# EAGLE design BOOSTXL_C2KLED (EAGLE 5.11)

## Sheet 1 of 4
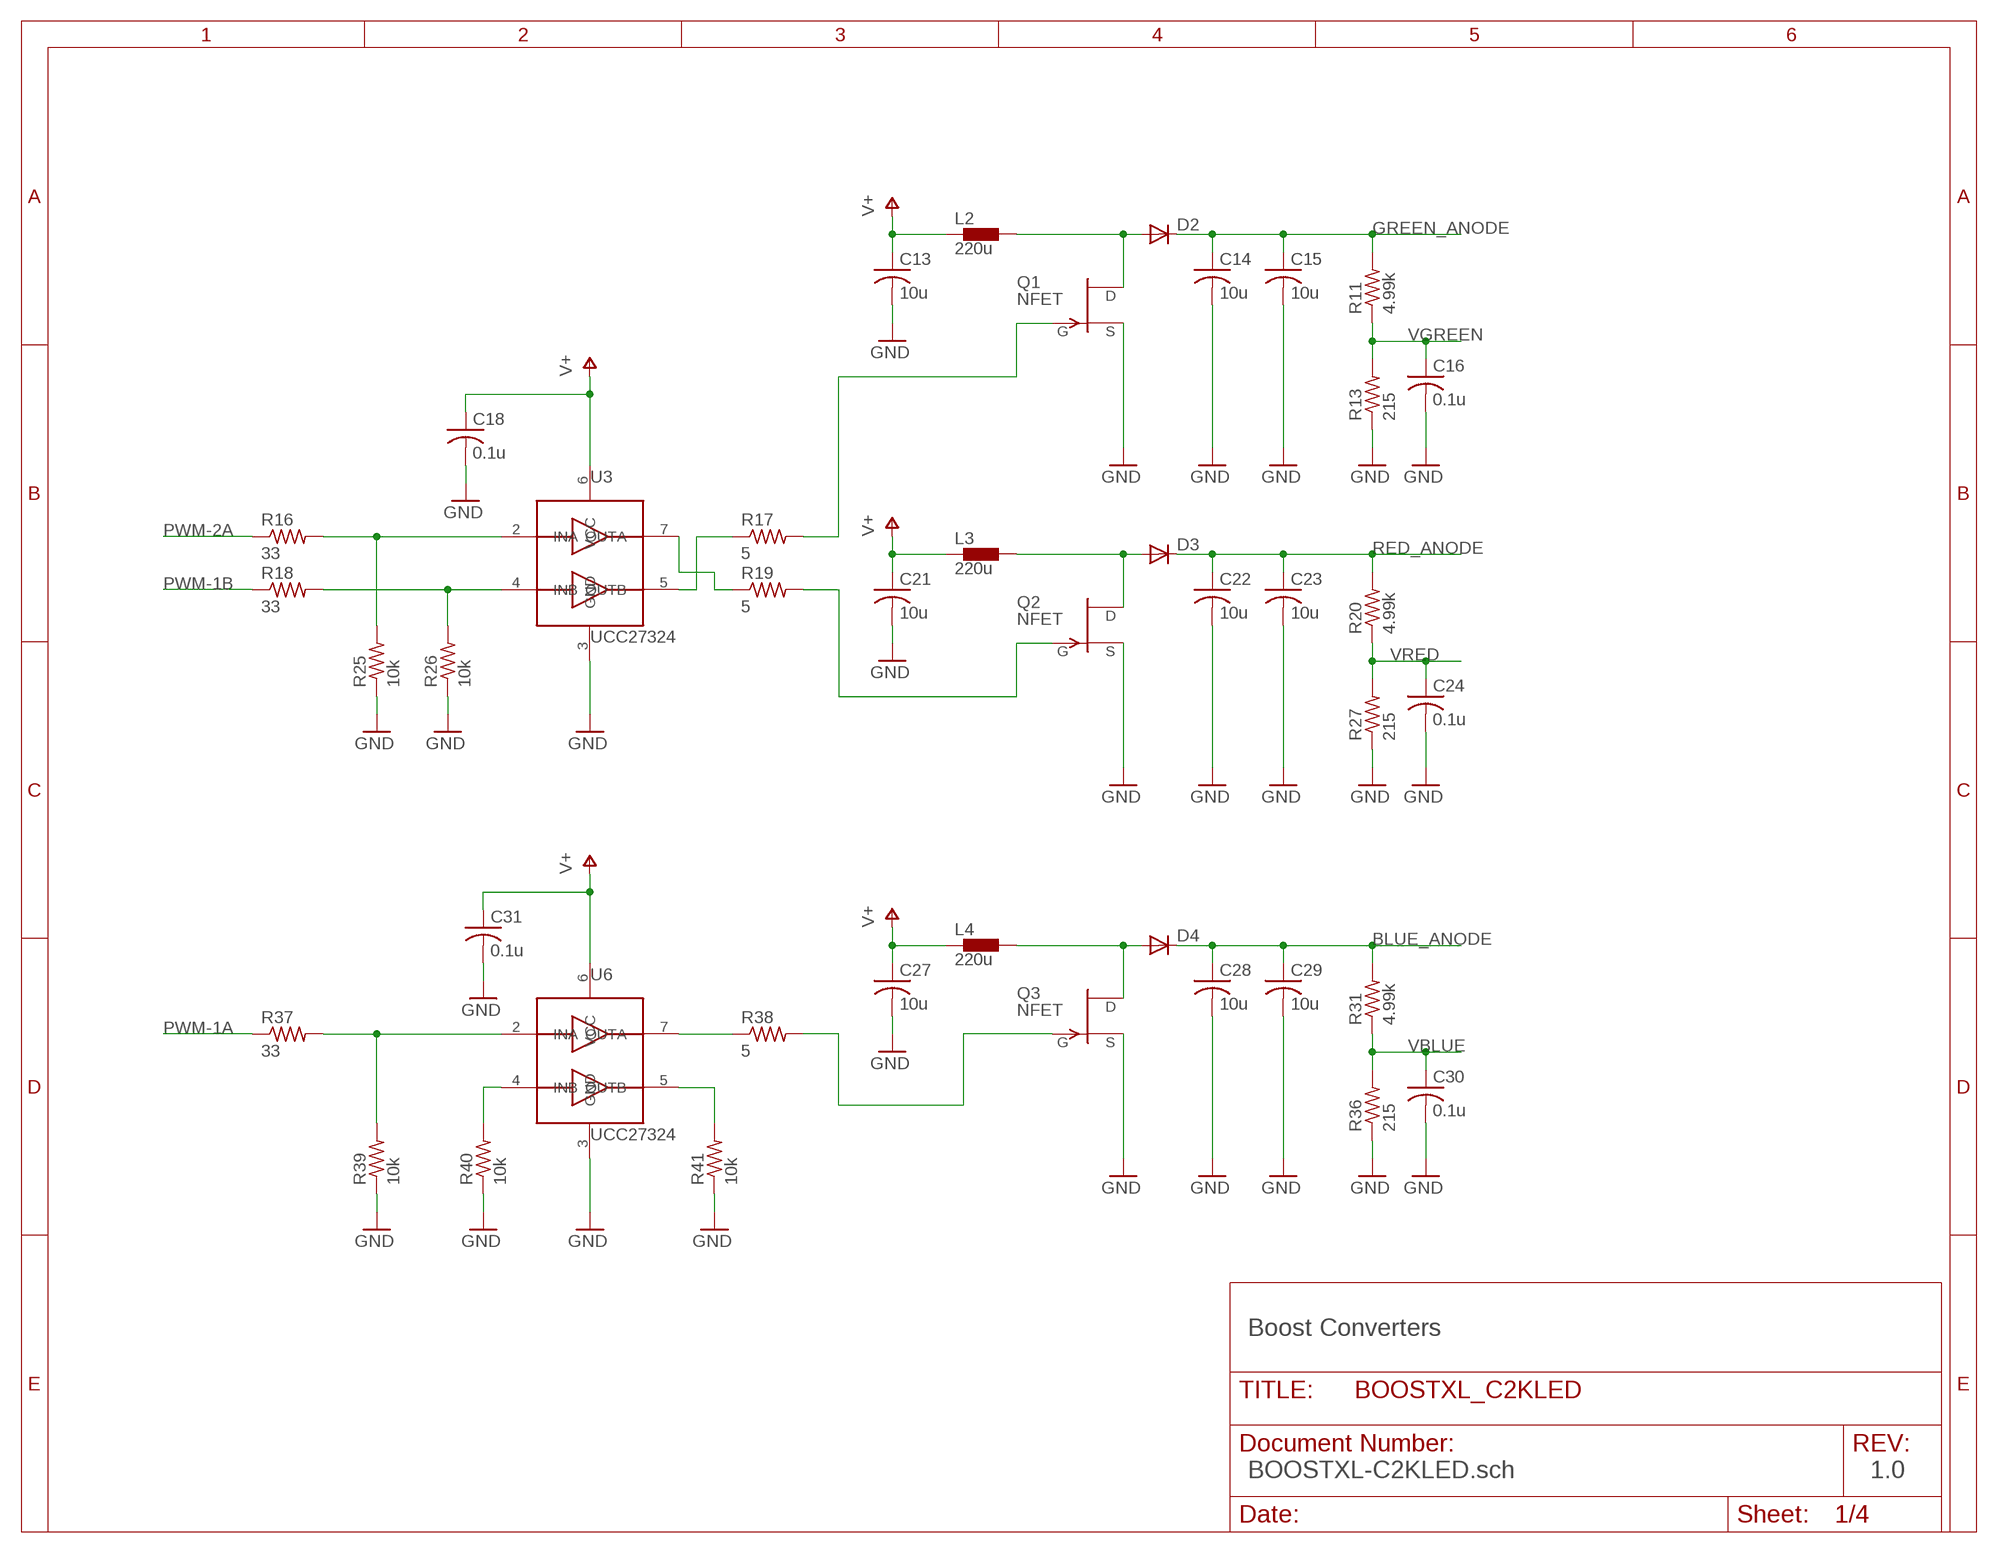
[diagram p0: schematic, sheet 1]

### Parts
C13  10u  C-USC1210  [C1210]
C14  10u  C-USC1210  [C1210]
C15  10u  C-USC1210  [C1210]
C16  0.1u  C-USC0402  [C0402]
C18  0.1u  C-USC0402  [C0402]
C21  10u  C-USC1210  [C1210]
C22  10u  C-USC1210  [C1210]
C23  10u  C-USC1210  [C1210]
C24  0.1u  C-USC0402  [C0402]
C27  10u  C-USC1210  [C1210]
C28  10u  C-USC1210  [C1210]
C29  10u  C-USC1210  [C1210]
C30  0.1u  C-USC0402  [C0402]
C31  0.1u  C-USC0402  [C0402]
D2  DIODE-DO214AC  [DO214AC]
D3  DIODE-DO214AC  [DO214AC]
D4  DIODE-DO214AC  [DO214AC]
L2  220u  SRR7032  [SRR7032]
L3  220u  SRR7032  [SRR7032]
L4  220u  SRR7032  [SRR7032]
Q1  NFET  [TO252]
Q2  NFET  [TO252]
Q3  NFET  [TO252]
R11  4.99k  R-US_R0402  [R0402]
R13  215  R-US_R0402  [R0402]
R16  33  R-US_R0402  [R0402]
R17  5  R-US_R0402  [R0402]
R18  33  R-US_R0402  [R0402]
R19  5  R-US_R0402  [R0402]
R20  4.99k  R-US_R0402  [R0402]
R25  10k  R-US_R0402  [R0402]
R26  10k  R-US_R0402  [R0402]
R27  215  R-US_R0402  [R0402]
R31  4.99k  R-US_R0402  [R0402]
R36  215  R-US_R0402  [R0402]
R37  33  R-US_R0402  [R0402]
R38  5  R-US_R0402  [R0402]
R39  10k  R-US_R0402  [R0402]
R40  10k  R-US_R0402  [R0402]
R41  10k  R-US_R0402  [R0402]
U3  UCC27324  [SO-08]
U6  UCC27324  [SO-08]

### Nets
BLUE_ANODE: C28.1 C29.1 D4.C R31.2 ; also sheet 2
GND: C13.2 C14.2 C15.2 C16.2 C18.2 C21.2 C22.2 C23.2 C24.2 C27.2 C28.2 C29.2 C30.2 C31.2 Q1.2(S) Q2.2(S) Q3.2(S) R13.1 R25.1 R26.1 R27.1 R36.1 R39.1 R40.1 R41.1 U3.3(GND) U6.3(GND) ; also sheet 2,3,4
GREEN_ANODE: C14.1 C15.1 D2.C R11.2 ; also sheet 2
N$15: R16.2 R25.2 U3.2(INA)
N$16: R38.1 U6.7(OUTA)
N$24: R17.1 U3.5(OUTB)
N$31: R18.2 R26.2 U3.4(INB)
N$32: Q3.1(G) R38.2
N$33: D4.A L4.P$2 Q3.3(D)
N$34: R37.2 R39.2 U6.2(INA)
N$43: R19.1 U3.7(OUTA)
N$44: Q2.1(G) R19.2
N$45: Q1.1(G) R17.2
N$46: D2.A L2.P$2 Q1.3(D)
N$47: D3.A L3.P$2 Q2.3(D)
N$85: R40.2 U6.4(INB)
N$86: R41.2 U6.5(OUTB)
PWM-1A: R37.1 ; also sheet 4
PWM-1B: R18.1 ; also sheet 4
PWM-2A: R16.1 ; also sheet 4
RED_ANODE: C22.1 C23.1 D3.C R20.2 ; also sheet 2
V+: C13.1 C18.1 C21.1 C27.1 C31.1 L2.P$1 L3.P$1 L4.P$1 U3.6(VCC) U6.6(VCC) ; also sheet 3
VBLUE: C30.1 R31.1 R36.2 ; also sheet 4
VGREEN: C16.1 R11.1 R13.2 ; also sheet 4
VRED: C24.1 R20.1 R27.2 ; also sheet 4

### Notes on the sheet
- Boost Converters
- BOOSTXL-C2KLED.sch | 1.0

## Sheet 2 of 4
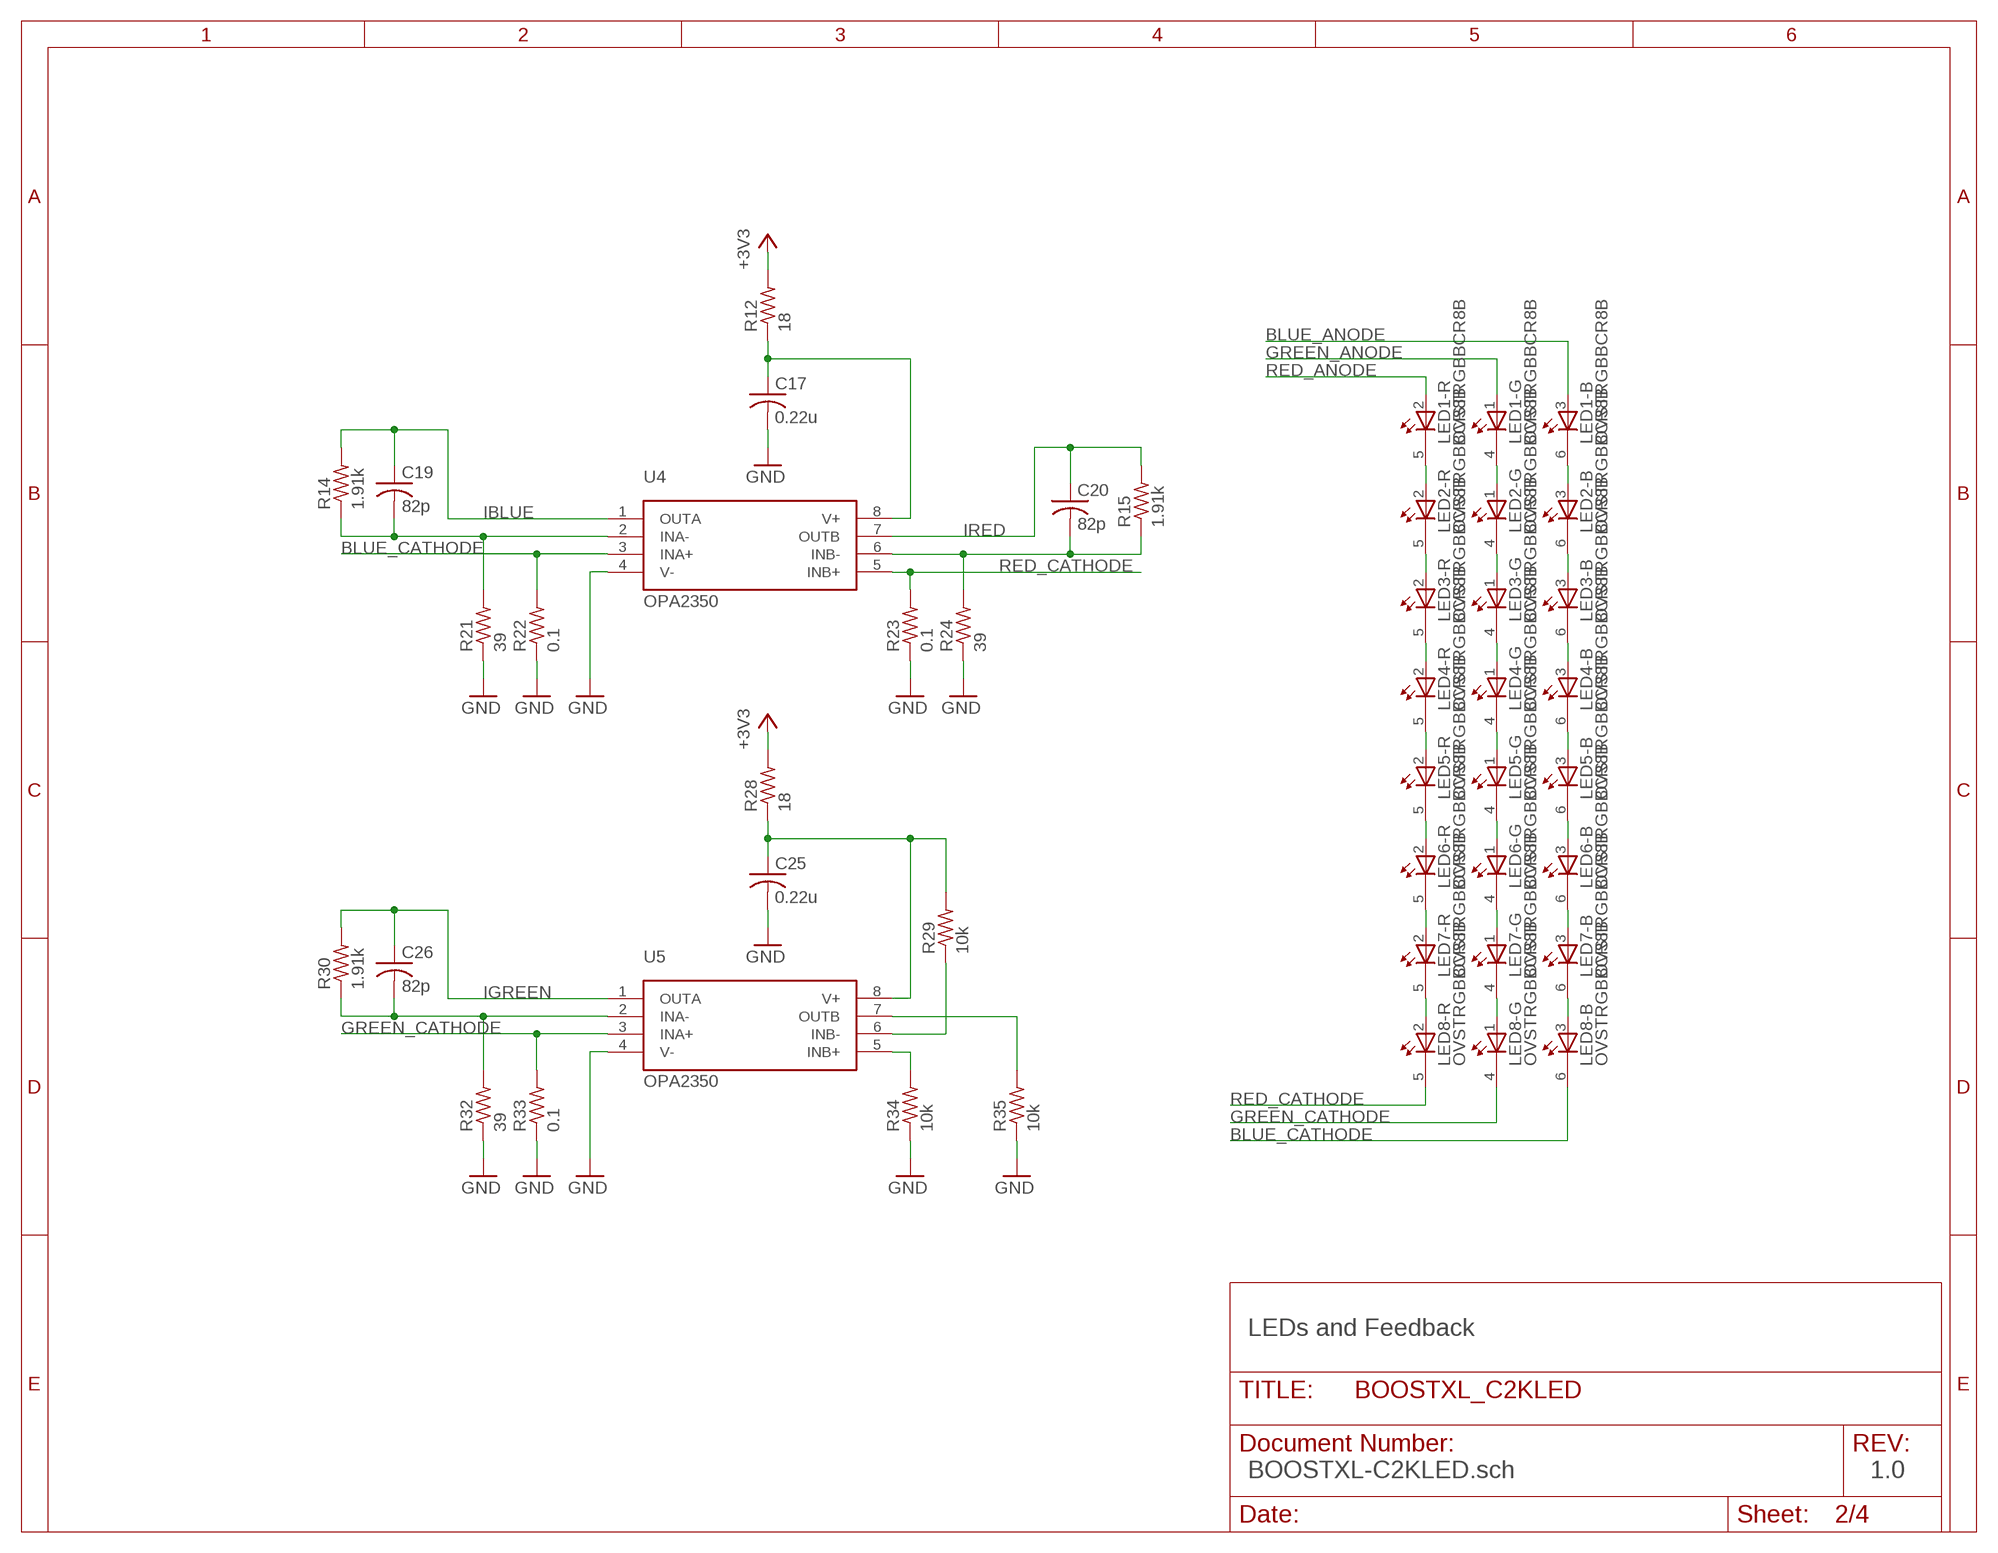
[diagram p1: schematic, sheet 2]

### Parts
C17  0.22u  C-USC0402  [C0402]
C19  82p  C-USC0402  [C0402]
C20  82p  C-USC0402  [C0402]
C25  0.22u  C-USC0402  [C0402]
C26  82p  C-USC0402  [C0402]
LED1  OVSTRGBBCR8B  [OVSTRGBBCR8-EVERLIGHT]
LED2  OVSTRGBBCR8B  [OVSTRGBBCR8-EVERLIGHT]
LED3  OVSTRGBBCR8B  [OVSTRGBBCR8-EVERLIGHT]
LED4  OVSTRGBBCR8B  [OVSTRGBBCR8-EVERLIGHT]
LED5  OVSTRGBBCR8B  [OVSTRGBBCR8-EVERLIGHT]
LED6  OVSTRGBBCR8B  [OVSTRGBBCR8-EVERLIGHT]
LED7  OVSTRGBBCR8B  [OVSTRGBBCR8-EVERLIGHT]
LED8  OVSTRGBBCR8B  [OVSTRGBBCR8-EVERLIGHT]
R12  18  R-US_R0402  [R0402]
R14  1.91k  R-US_R0402  [R0402]
R15  1.91k  R-US_R0402  [R0402]
R21  39  R-US_R0402  [R0402]
R22  0.1  R-US_R1206  [R1206]
R23  0.1  R-US_R1206  [R1206]
R24  39  R-US_R0402  [R0402]
R28  18  R-US_R0402  [R0402]
R29  10k  R-US_R0402  [R0402]
R30  1.91k  R-US_R0402  [R0402]
R32  39  R-US_R0402  [R0402]
R33  0.1  R-US_R1206  [R1206]
R34  10k  R-US_R0402  [R0402]
R35  10k  R-US_R0402  [R0402]
U4  OPA2350  [SO-08]
U5  OPA2350  [SO-08]

### Nets
+3V3: R12.2 R28.2 ; also sheet 3,4
BLUE_ANODE: LED1.3(-B:A) ; also sheet 1
BLUE_CATHODE: LED8.6(-B:C) R22.2 U4.3(INA+)
GND: C17.2 C25.2 R21.1 R22.1 R23.1 R24.1 R32.1 R33.1 R34.1 R35.1 U4.4(V-) U5.4(V-) ; also sheet 1,3,4
GREEN_ANODE: LED1.1(-G:A) ; also sheet 1
GREEN_CATHODE: LED8.4(-G:C) R33.2 U5.3(INA+)
IBLUE: C19.1 R14.2 U4.1(OUTA) ; also sheet 4
IGREEN: C26.1 R30.2 U5.1(OUTA) ; also sheet 4
IRED: C20.1 R15.2 U4.7(OUTB) ; also sheet 4
N$14: LED1.5(-R:C) LED2.2(-R:A)
N$17: LED1.4(-G:C) LED2.1(-G:A)
N$18: LED1.6(-B:C) LED2.3(-B:A)
N$21: LED2.5(-R:C) LED3.2(-R:A)
N$22: LED2.4(-G:C) LED3.1(-G:A)
N$23: LED2.6(-B:C) LED3.3(-B:A)
N$25: LED3.5(-R:C) LED4.2(-R:A)
N$26: LED3.4(-G:C) LED4.1(-G:A)
N$27: LED3.6(-B:C) LED4.3(-B:A)
N$28: LED4.5(-R:C) LED5.2(-R:A)
N$35: R35.2 U5.7(OUTB)
N$36: C26.2 R30.1 R32.2 U5.2(INA-)
N$37: C19.2 R14.1 R21.2 U4.2(INA-)
N$39: C25.1 R28.1 R29.2 U5.8(V+)
N$40: C20.2 R15.1 R24.2 U4.6(INB-)
N$42: C17.1 R12.1 U4.8(V+)
N$50: LED4.4(-G:C) LED5.1(-G:A)
N$51: LED4.6(-B:C) LED5.3(-B:A)
N$59: LED5.5(-R:C) LED6.2(-R:A)
N$60: LED5.4(-G:C) LED6.1(-G:A)
N$61: LED5.6(-B:C) LED6.3(-B:A)
N$62: LED6.5(-R:C) LED7.2(-R:A)
N$63: LED6.4(-G:C) LED7.1(-G:A)
N$64: LED6.6(-B:C) LED7.3(-B:A)
N$65: LED7.5(-R:C) LED8.2(-R:A)
N$66: LED7.4(-G:C) LED8.1(-G:A)
N$67: LED7.6(-B:C) LED8.3(-B:A)
N$71: R29.1 U5.6(INB-)
N$72: R34.2 U5.5(INB+)
RED_ANODE: LED1.2(-R:A) ; also sheet 1
RED_CATHODE: LED8.5(-R:C) R23.2 U4.5(INB+)
Unconnected: LED1.4@1(-G:C) LED1.5@1(-R:C) LED1.6@1(-B:C) LED2.4@1(-G:C) LED2.5@1(-R:C) LED2.6@1(-B:C) LED3.4@1(-G:C) LED3.5@1(-R:C) LED3.6@1(-B:C) LED4.4@1(-G:C) LED4.5@1(-R:C) LED4.6@1(-B:C) LED5.4@1(-G:C) LED5.5@1(-R:C) LED5.6@1(-B:C) LED6.4@1(-G:C) LED6.5@1(-R:C) LED6.6@1(-B:C) LED7.4@1(-G:C) LED7.5@1(-R:C) LED7.6@1(-B:C) LED8.4@1(-G:C) LED8.5@1(-R:C) LED8.6@1(-B:C)

### Notes on the sheet
- LEDs and Feedback
- BOOSTXL-C2KLED.sch | 1.0

## Sheet 3 of 4
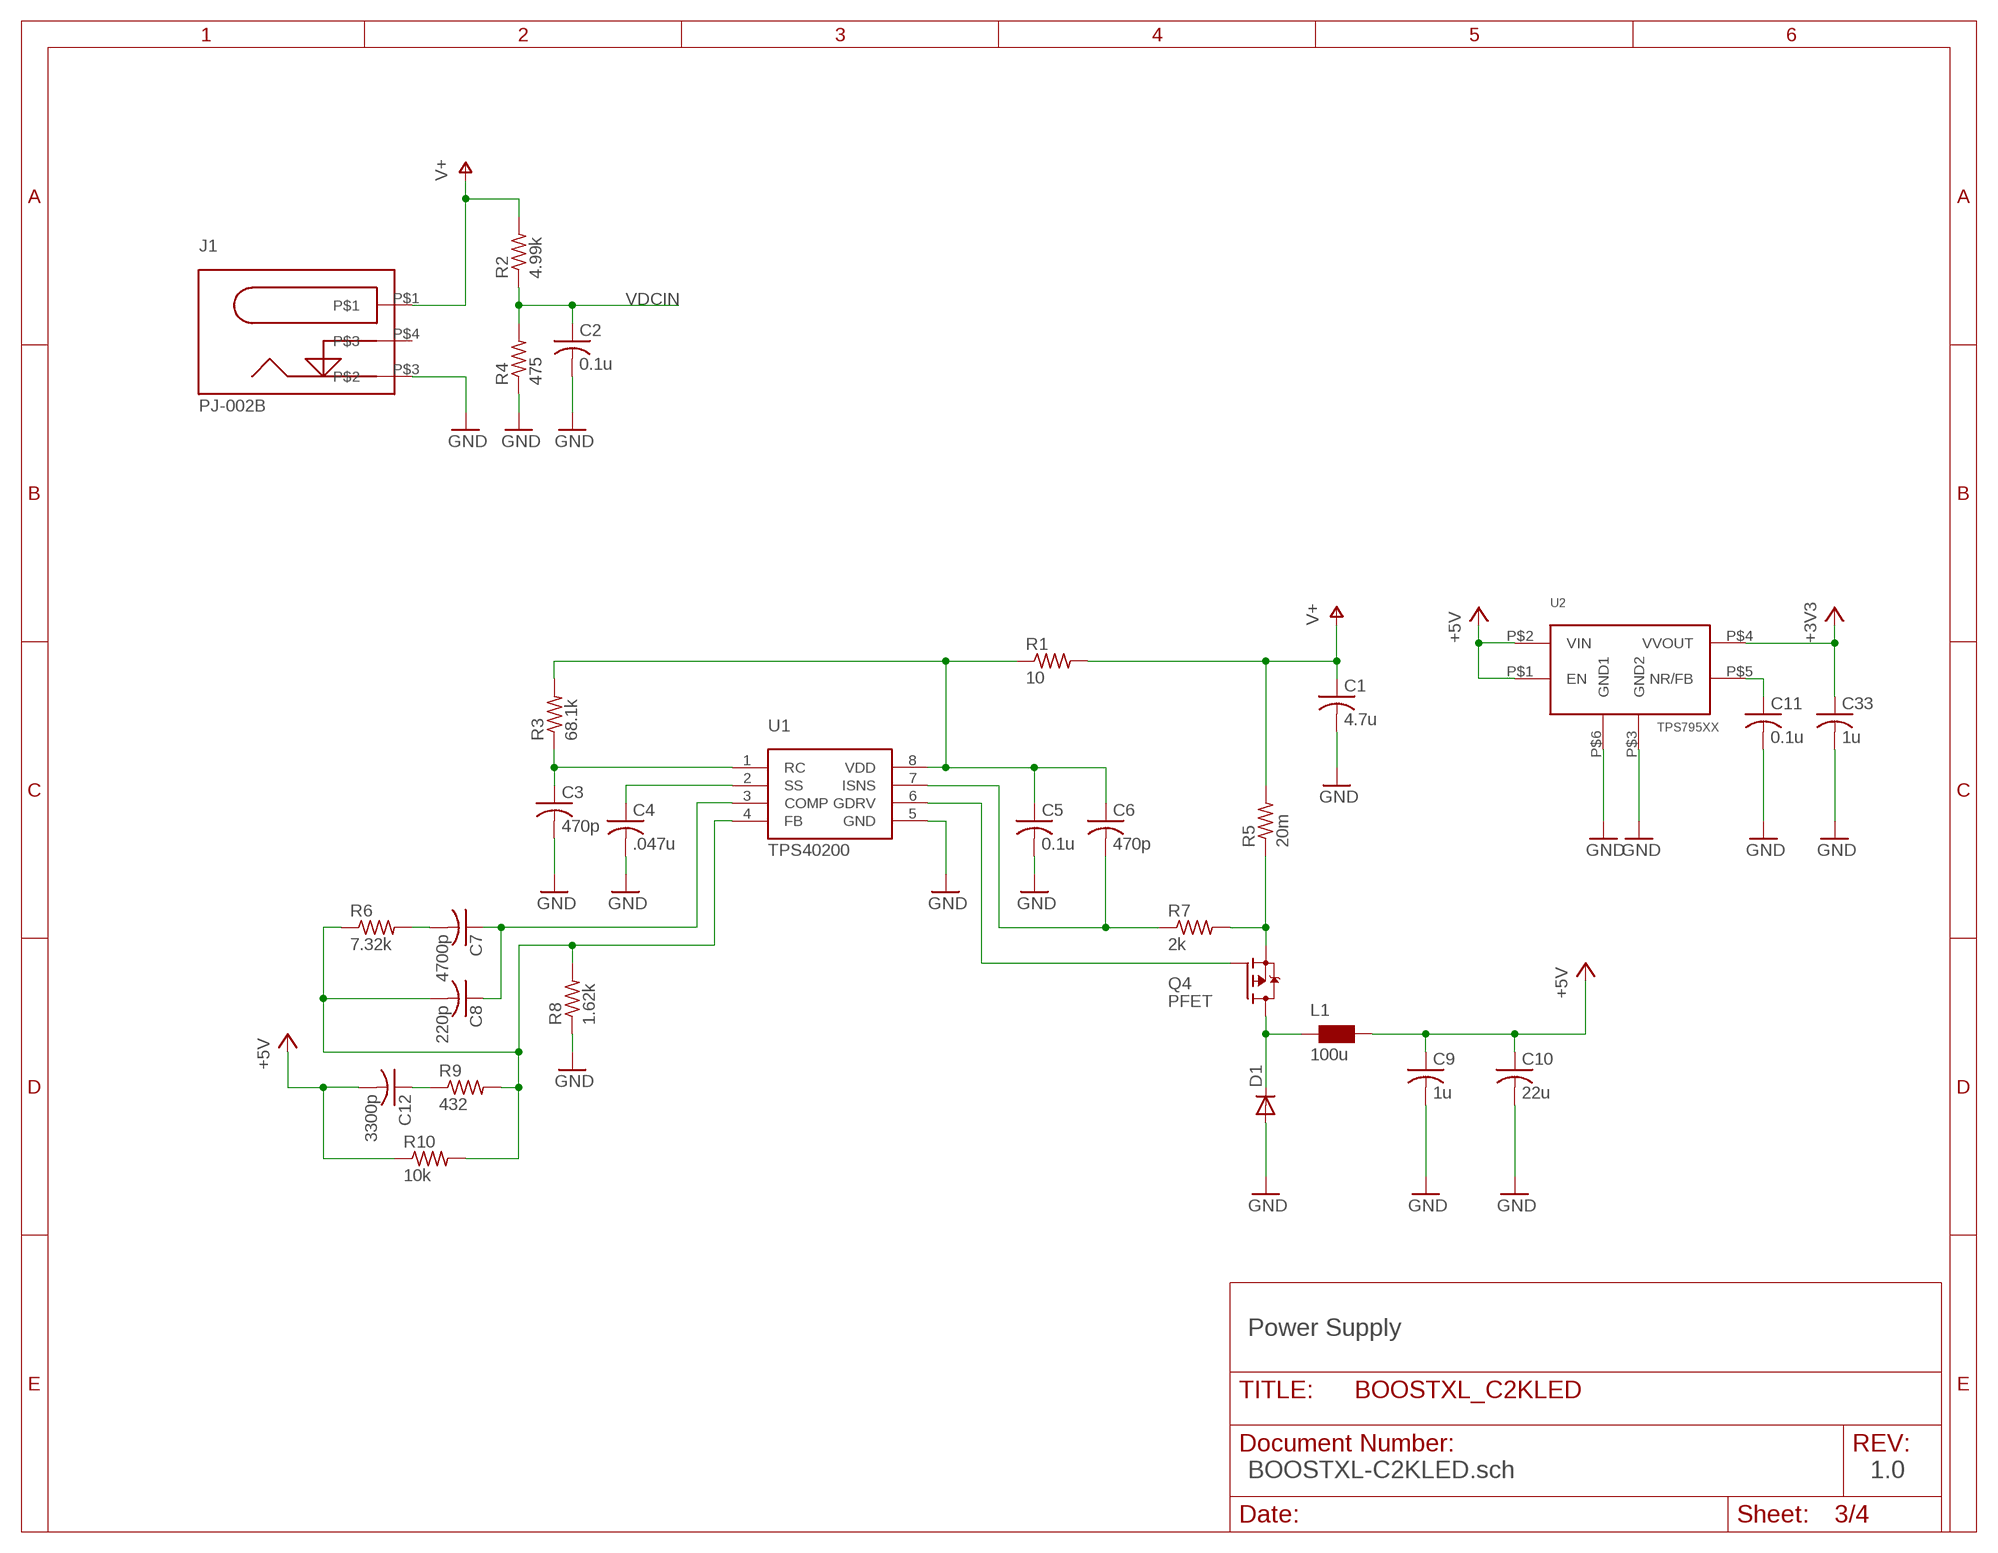
[diagram p2: schematic, sheet 3]

### Parts
C1  4.7u  C-USC1206  [C1206]
C2  0.1u  C-USC0402  [C0402]
C3  470p  C-USC0402  [C0402]
C4  .047u  C-USC0402  [C0402]
C5  0.1u  C-USC0402  [C0402]
C6  470p  C-USC0402  [C0402]
C7  4700p  C-USC0402  [C0402]
C8  220p  C-USC0402  [C0402]
C9  1u  C-USC0402  [C0402]
C10  22u  C-USC1206  [C1206]
C11  0.1u  C-USC0402  [C0402]
C12  3300p  C-USC0402  [C0402]
C33  1u  C-USC0402  [C0402]
D1  DIODE-DO214AC  [DO214AC]
J1  PJ-002B  [PJ-002B-SMT]
L1  100u  WE-PD2_L  [WE-PD2_L]
Q4  PFET  [SOT23]
R1  10  R-US_R0402  [R0402]
R2  4.99k  R-US_R0402  [R0402]
R3  68.1k  R-US_R0402  [R0402]
R4  475  R-US_R0402  [R0402]
R5  20m  R-US_R2010  [R2010]
R6  7.32k  R-US_R0402  [R0402]
R7  2k  R-US_R0402  [R0402]
R8  1.62k  R-US_R0402  [R0402]
R9  432  R-US_R0402  [R0402]
R10  10k  R-US_R0402  [R0402]
U1  TPS40200  [SO-08]
U2  TPS795XX  [SOT223-6-DCQ]

### Nets
+3V3: C33.1 U2.P$4(VVOUT) ; also sheet 2,4
+5V: C9.1 C10.1 C12.2 L1.1 R10.1 U2.P$1(EN) U2.P$2(VIN) ; also sheet 4
GND: C1.2 C2.2 C3.2 C4.2 C5.2 C9.2 C10.2 C11.2 C33.2 D1.A J1.P$3 R4.1 R8.1 U1.5(GND) U2.P$3(GND2) U2.P$6(GND1) ; also sheet 1,2,4
N$1: C3.1 R3.1 U1.1(RC)
N$2: C4.1 U1.2(SS)
N$3: C7.1 C8.1 U1.3(COMP)
N$5: C7.2 R6.2
N$6: D1.C L1.2 Q4.3(D)
N$7: C12.1 R9.1
N$9: C5.1 C6.1 R1.1 R3.2 U1.8(VDD)
N$10: C6.2 R7.1 U1.7(ISNS)
N$11: Q4.2(S) R5.1 R7.2
N$19: Q4.1(G) U1.6(GDRV)
N$30: C11.1 U2.P$5(NR/FB)
N$52: C8.2 R6.1 R8.2 R9.2 R10.2 U1.4(FB)
V+: C1.1 J1.P$1 R1.2 R2.2 R5.2 ; also sheet 1
VDCIN: C2.1 R2.1 R4.2 ; also sheet 4
Unconnected: J1.P$4

### Notes on the sheet
- Power Supply
- BOOSTXL-C2KLED.sch | 1.0

## Sheet 4 of 4
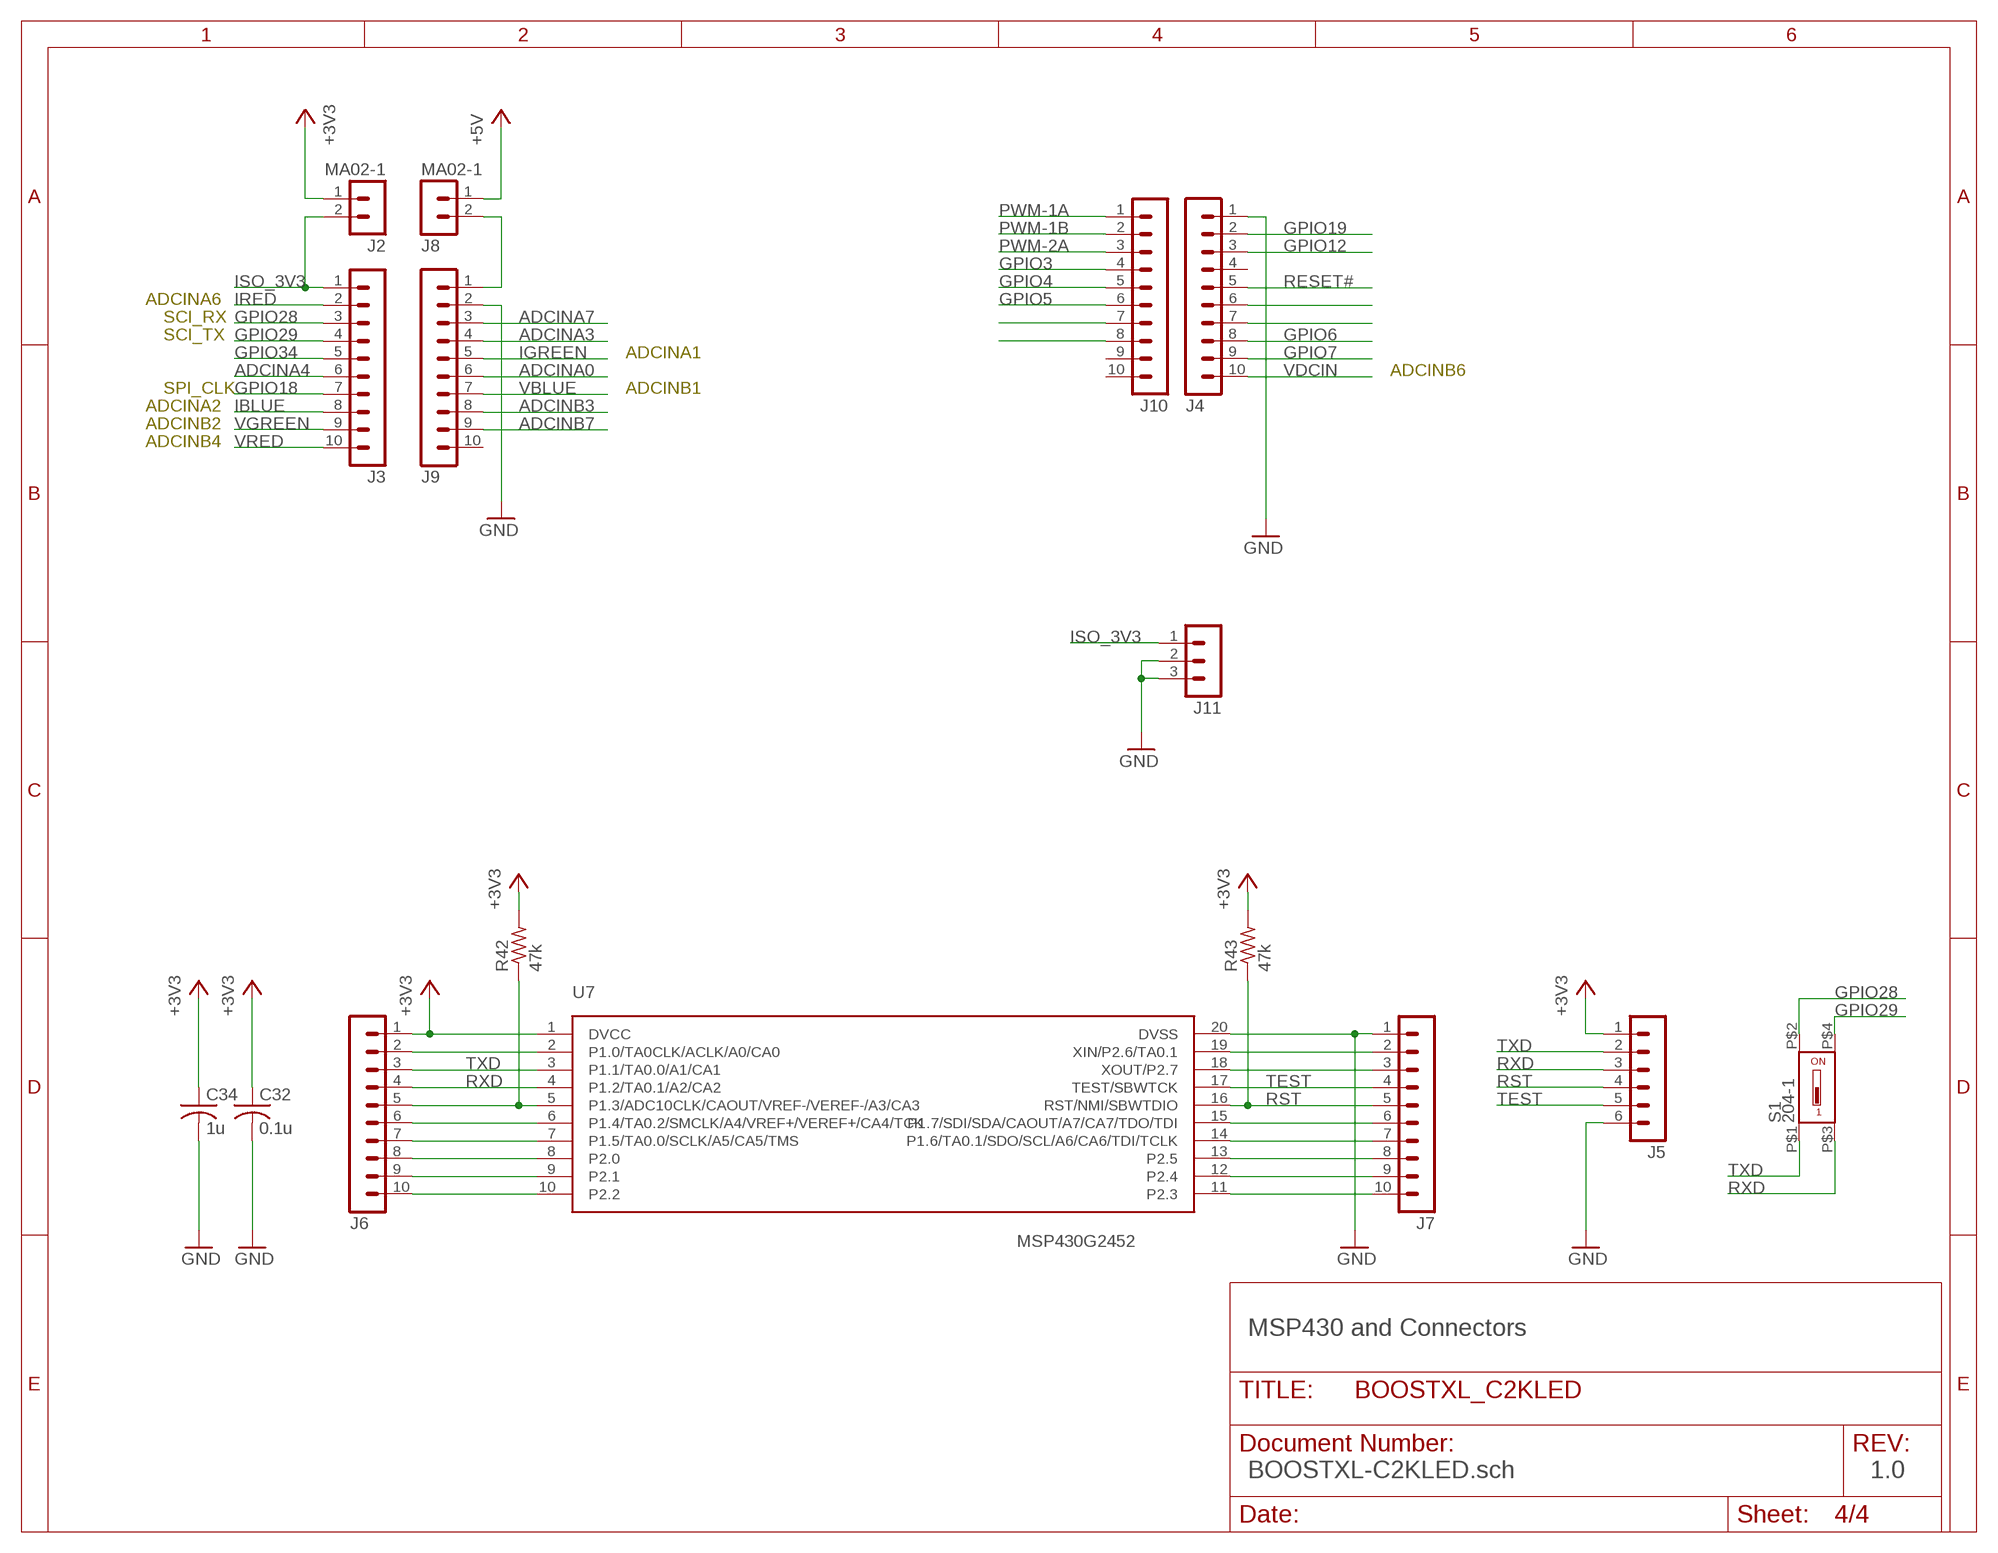
[diagram p3: schematic, sheet 4]

### Parts
C32  0.1u  C-USC0402  [C0402]
C34  1u  C-USC0402  [C0402]
J2  MA02-1  [MA02-1]
J3  MA10-1  [MA10-1]
J4  MA10-1  [MA10-1]
J5  MA06-1  [MA06-1]
J6  MA10-1  [MA10-1]
J7  MA10-1  [MA10-1]
J8  MA02-1  [MA02-1]
J9  MA10-1  [MA10-1]
J10  MA10-1  [MA10-1]
J11  MA03-1  [MA03-1]
R42  47k  R-US_R0402  [R0402]
R43  47k  R-US_R0402  [R0402]
S1  204-1  [CTS-204-1]
U7  MSP430G2452  [PW_R-PDSO-G20]

### Nets
+3V3: C32.1 C34.1 J2.1 J5.1 J6.1 R42.2 R43.2 U7.1(DVCC) ; also sheet 2,3
+5V: J8.1 ; also sheet 3
ADCINA0: J9.6
ADCINA3: J9.4
ADCINA4: J3.6
ADCINA7: J9.3
ADCINB3: J9.8
ADCINB7: J9.9
GND: C32.2 C34.2 J4.1 J5.6 J7.1 J9.2 J11.2 J11.3 U7.20(DVSS) ; also sheet 1,2,3
GPIO3: J10.4
GPIO4: J10.5
GPIO5: J10.6
GPIO6: J4.8
GPIO7: J4.9
GPIO12: J4.3
GPIO18: J3.7
GPIO19: J4.2
GPIO28: J3.3 S1.P$2
GPIO29: J3.4 S1.P$4
GPIO34: J3.5
IBLUE: J3.8 ; also sheet 2
IGREEN: J9.5 ; also sheet 2
IRED: J3.2 ; also sheet 2
ISO_3V3: J2.2 J3.1 J11.1
N$4: J6.10 U7.10(P2.2)
N$8: J6.9 U7.9(P2.1)
N$12: J6.8 U7.8(P2.0)
N$13: J4.6
N$20: J6.7 U7.7(P1.5/TA0.0/SCLK/A5/CA5/TMS)
N$29: J6.6 U7.6(P1.4/TA0.2/SMCLK/A4/VREF+/VEREF+/CA4/TCK)
N$38: J6.5 R42.1 U7.5(P1.3/ADC10CLK/CAOUT/VREF-/VEREF-/A3/CA3)
N$48: J4.7
N$49: J6.2 U7.2(P1.0/TA0CLK/ACLK/A0/CA0)
N$53: J7.2 U7.19(XIN/P2.6/TA0.1)
N$54: J7.3 U7.18(XOUT/P2.7)
N$55: J10.7
N$56: J10.8
N$57: J7.6 U7.15(P1.7/SDI/SDA/CAOUT/A7/CA7/TDO/TDI)
N$58: J7.7 U7.14(P1.6/TA0.1/SDO/SCL/A6/CA6/TDI/TCLK)
N$68: J7.8 U7.13(P2.5)
N$69: J7.9 U7.12(P2.4)
N$70: J7.10 U7.11(P2.3)
N$75: J8.2 J9.1
PWM-1A: J10.1 ; also sheet 1
PWM-1B: J10.2 ; also sheet 1
PWM-2A: J10.3 ; also sheet 1
RESET#: J4.5
RST: J5.4 J7.5 R43.1 U7.16(RST/NMI/SBWTDIO)
RXD: J5.3 J6.4 S1.P$3 U7.4(P1.2/TA0.1/A2/CA2)
TEST: J5.5 J7.4 U7.17(TEST/SBWTCK)
TXD: J5.2 J6.3 S1.P$1 U7.3(P1.1/TA0.0/A1/CA1)
VBLUE: J9.7 ; also sheet 1
VDCIN: J4.10 ; also sheet 3
VGREEN: J3.9 ; also sheet 1
VRED: J3.10 ; also sheet 1
Unconnected: J4.4 J9.10 J10.9 J10.10

### Notes on the sheet
- ADCINA6
- SCI_RX
- SCI_TX
- ADCINA1
- ADCINB6
- SPI_CLK | ADCINB1
- ADCINA2
- ADCINB2
- ADCINB4
- MSP430 and Connectors
- BOOSTXL-C2KLED.sch | 1.0

## Library data of the parts
C1-C34 = rcl:C-US: CAPACITOR, American symbol
D1-D4 = diode:DIODE-: DIODE
J1 = con-cui:PJ-002B
J2 J8 = con-lstb:MA02-1
J3 J4 J6 J7 J9 J10 = con-lstb:MA10-1: PIN HEADER; OC_FARNELL: unknown; OC_NEWARK: unknown
J5 = con-lstb:MA06-1: PIN HEADER; OC_FARNELL: unknown; OC_NEWARK: unknown
J11 = con-lstb:MA03-1: PIN HEADER; OC_FARNELL: unknown; OC_NEWARK: unknown
L1 = wuerth-elektronik:WE-PD2: SMD-Power Inductors WE-PD2 Is recommended for the application with switching regulators from National Semiconductor, Linear Technology, Texas Instruments and Fairchild Semiconductor -- Switching regulators with low operating voltages (computer, laptop, mobile phones, pagers) -- Integrated DC/DC-converter
L2-L4 = inductors:SRR7032
LED1-LED8 = texas:OVSTRGBBCR8: Full Color PLCC6 LED OVSTRGBBCR8 Source: www.optekinc.com .. ovstrgbbcr8.pdf
Q1-Q3 = texas:NFET
Q4 = transistor-fet:PFET
R1-R43 = rcl:R-US_: RESISTOR, American symbol
S1 = switch-dil:204-1*
U1 = texas:TPS40200
U2 = texas:TPS795XX
U3 U6 = texas:UCC27324
U4 U5 = texas:OPA2350
U7 = texas:MSP430G2452

## Net classes
0 default: width 0.152 mm, drill 0.305 mm, clearance 0.152 mm

## Board
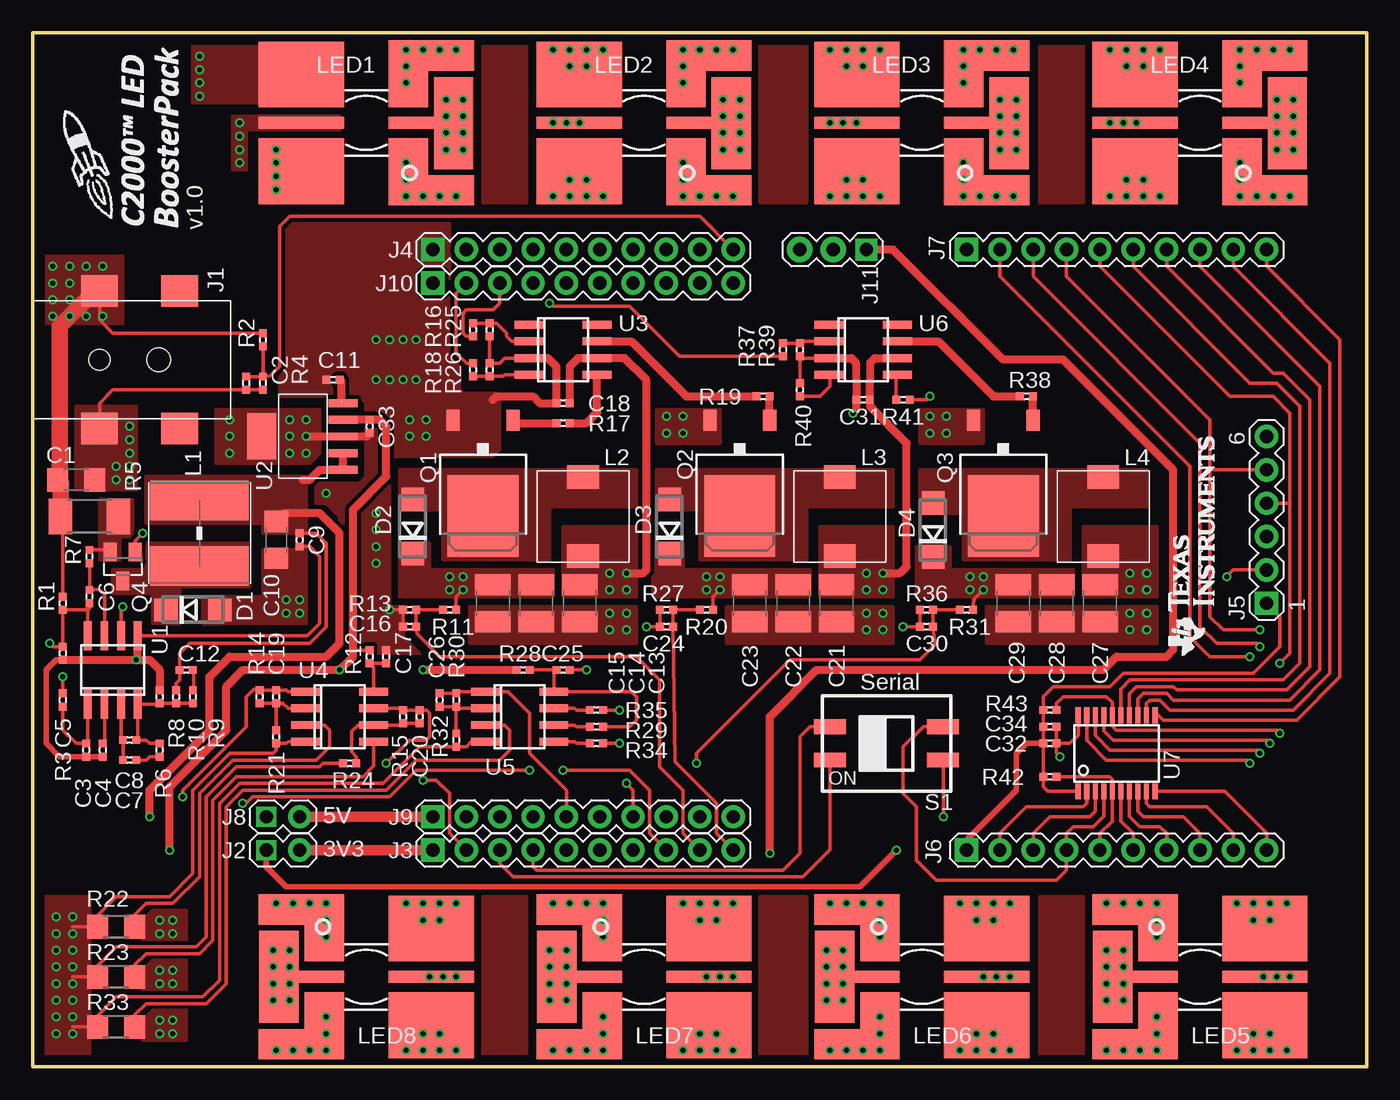
[diagram p4: board, top side]
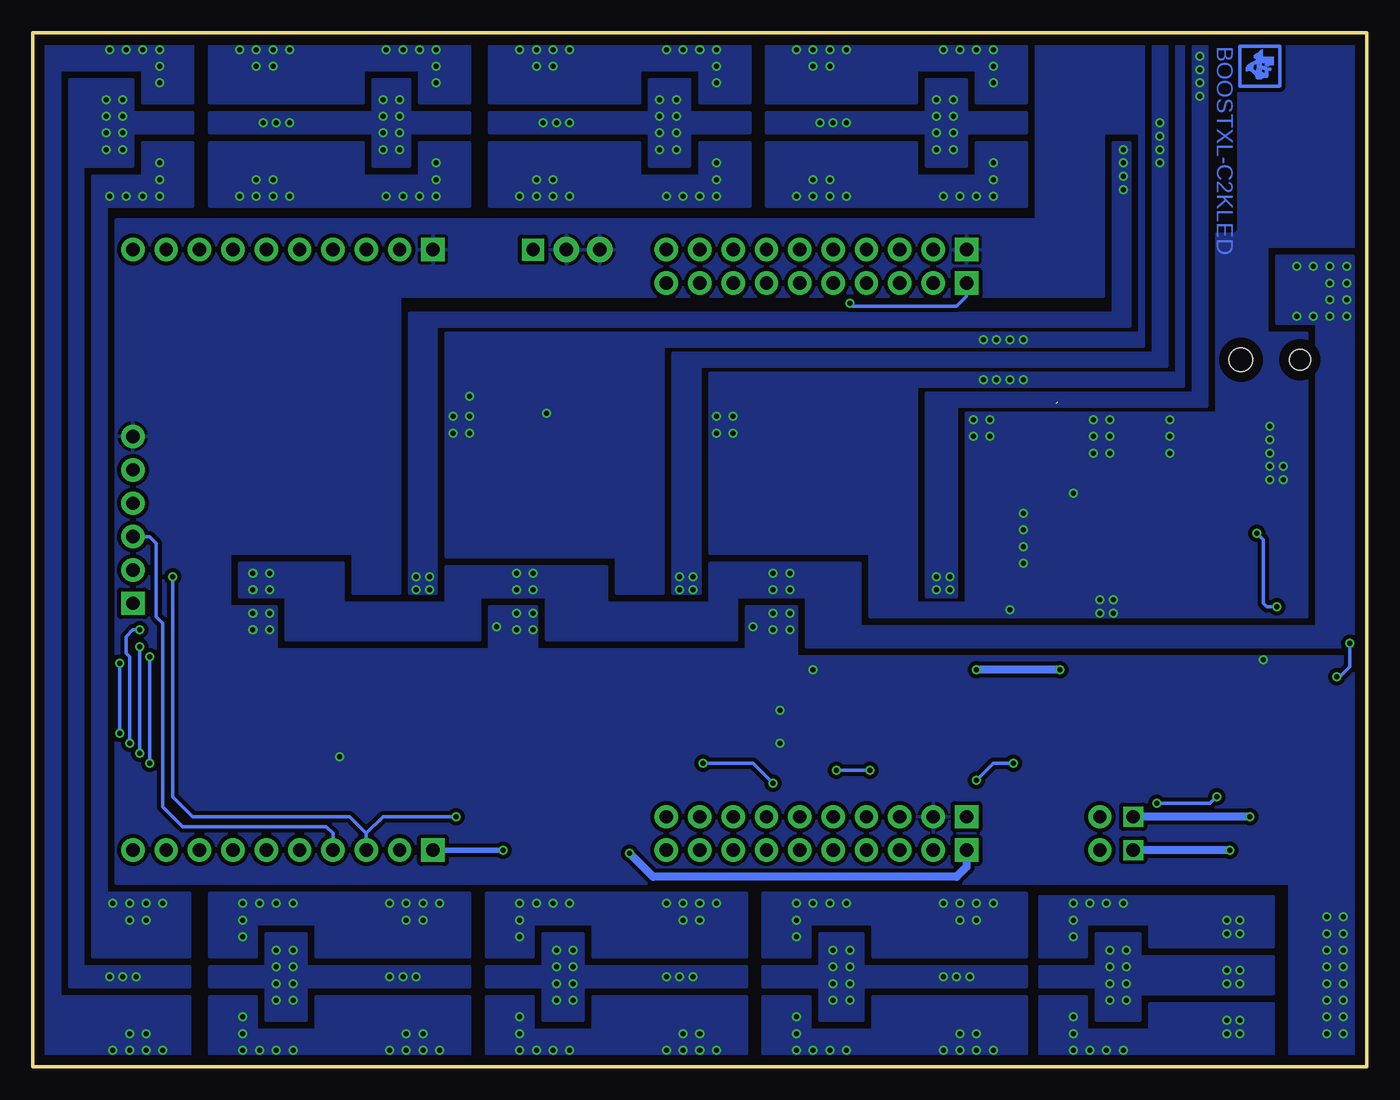
[diagram p5: board, bottom side, seen from below]

Size 101.6 x 78.74 mm. Coordinates in mm from the lower left corner, seen from the top.
Outline: 0,78.74 101.6,78.74 101.6,0 0,0 0,78.74
Copper layers (1*16): Top 0.035mm / dielectric 1.5mm / Bottom 0.035mm
Design rules "default *": minimum track width 6mil, minimum drill 15mil, track to track 6mil, track to pad 6mil, pad to pad 6mil, via to via 6mil, smd to smd 6mil, copper to edge 30mil, drill to drill 12mil, minimum pad ring 6mil, minimum via ring 6mil, stop-mask expansion 1mil, vias tented up to drill 20mil, thermal gap 10mil
bRestrict: area 6.9,74.9 to 9.4,77.5

### Footprints (pad centres in the part's own frame; a part is rotated, then mirrored left to right if it is on the bottom)
C1206 = smd 1.6 x 1.8: 1 -1.4,0; 2 1.4,0
C0402 = smd 0.6 x 0.6: 1 -0.5,0; 2 0.5,0
C1210 = smd 1.6 x 2.7: 1 -1.4,0; 2 1.4,0
DO214AC = smd 1.8 x 1.7: A 2.05,0; C -2.05,0
PJ-002B-SMT = smd 2.8 x 2.4: P$1 0,5.25; P$2 6.1,5.25; P$3 0,-5.25; P$4 6.1,-5.25 | hole 1.6: 0,0 | hole 1.8: 4.5,0
MA02-1 = drill 1.016 square: 1 -1.27,0 | drill 1.016 pad 1.778 round: 2 1.27,0
MA10-1 = drill 1.016 pad 1.778 square: 1 -11.43,0 | drill 1.016 pad 1.778 round: 2 -8.89,0; 3 -6.35,0; 4 -3.81,0; 5 -1.27,0; 6 1.27,0; 7 3.81,0; 8 6.35,0; 9 8.89,0; 10 11.43,0
MA06-1 = drill 1.016 pad 1.778 square: 1 -6.35,0 | drill 1.016 pad 1.778 round: 2 -3.81,0; 3 -1.27,0; 4 1.27,0; 5 3.81,0; 6 6.35,0
MA03-1 = drill 1.016 pad 1.676 square: 1 -2.54,0 | drill 1.016 pad 1.93 round: 2 0,0; 3 2.54,0
WE-PD2_L = smd 3 x 7.5: 1 -2.5,0; 2 2.5,0
SRR7032 = smd 2.4 x 1.8: P$1 0,-3; P$2 0,3
OVSTRGBBCR8-EVERLIGHT = smd 6.5 x 5: 1 -4.942,3.686; 3 -4.942,-3.686 | smd 6.5 x 0.9: 2 -4.942,0 | smd 3 x 5: 4 3.192,3.686; 6 3.192,-3.686 | smd 6.5 x 2.3: 4@1 4.942,5.136; 6@1 4.942,-5.136 | smd 5 x 0.9: 5 4.192,0 | smd 3 x 7: 5@1 6.65,-0.025
TO252 = smd 1 x 1.6: 1 -2.28,-4.8; 2 2.28,-4.8 | smd 5.4 x 6.2: 3 0,2.5
SOT23 = smd 1 x 1.4: 1 -0.95,-1.1; 2 0.95,-1.1; 3 0,1.1
R0402 = smd 0.6 x 0.6: 1 -0.5,0; 2 0.5,0
R2010 = smd 1.8 x 2.7: 1 -2.2,0; 2 2.2,0
R1206 = smd 1.6 x 1.803: 1 -1.422,0; 2 1.422,0
CTS-204-1 = smd 1.118 x 2.438: P$1 -1.27,-4.305; P$2 -1.27,4.305; P$3 1.27,-4.305; P$4 1.27,4.305
SO-08 = smd 0.6 x 2.2: 1 -1.905,-2.6; 2 -0.635,-2.6; 3 0.635,-2.6; 4 1.905,-2.6; 5 1.905,2.6; 6 0.635,2.6; 7 -0.635,2.6; 8 -1.905,2.6
SOT223-6-DCQ = smd 0.6 x 2.2: P$1 -2.54,0; P$2 -1.27,0; P$3 0,0; P$4 1.27,0; P$5 2.54,0 | smd 3.5 x 2.2: P$6 0,6.2
PW_R-PDSO-G20 = smd 0.4 x 1.2: 1 -2.925,-2.9; 2 -2.275,-2.9; 3 -1.625,-2.9; 4 -0.975,-2.9; 5 -0.325,-2.9; 6 0.325,-2.9; 7 0.975,-2.9; 8 1.625,-2.9; 9 2.275,-2.9; 10 2.925,-2.9; 11 2.925,2.9; 12 2.275,2.9; 13 1.625,2.9; 14 0.975,2.9; 15 0.325,2.9; 16 -0.325,2.9; 17 -0.975,2.9; 18 -1.625,2.9; 19 -2.275,2.9; 20 -2.925,2.9

### Placement (x,y rotation side)
C1  3.3,44.7 0 top
C2  16.26,52.07 270 top
C3  4.06,24.13 270 top
C4  5.33,24.13 270 top
C5  2.29,31.5 270 top
C6  4.32,35.81 90 top
C7  7.37,23.37 0 top
C8  7.37,24.89 0 top
C9  20.32,40.13 270 top
C10  18.54,40.13 270 top
C11  22.86,52.32 180 top
C12  11.68,30.23 180 top
C13  41.66,35.31 270 top
C14  38.35,35.31 270 top
C15  35.05,35.31 270 top
C16  28.7,33.53 180 top
C17  26.92,31.24 90 top
C18  40.39,50.55 180 top
C19  18.54,28.19 270 top
C20  29.46,26.67 270 top
C21  61.21,35.31 270 top
C22  57.91,35.31 270 top
C23  54.61,35.31 270 top
C24  48.26,33.53 180 top
C25  40.39,30.23 0 top
C26  30.99,27.94 270 top
C27  81.28,35.31 270 top
C28  77.98,35.31 270 top
C29  74.68,35.31 270 top
C30  68.07,33.53 180 top
C31  63.25,50.8 180 top
C32  77.47,24.64 0 top
C33  25.65,48.77 270 top
C34  77.47,25.91 0 top
D1  12.19,34.8 0 top
D2  28.96,41.15 90 top
D3  48.51,41.15 90 top
D4  68.58,40.89 90 top
J1  5.08,53.85 0 top
J2  19.05,16.51 0 top
J3  41.91,16.51 0 top
J4  41.91,62.23 0 top
J5  93.98,41.66 90 top
J6  82.55,16.51 0 top
J7  82.55,62.23 0 top
J8  19.05,19.05 0 top
J9  41.91,19.05 0 top
J10  41.91,59.69 0 top
J11  60.96,62.23 180 top
L1  12.7,40.64 270 top
L2  41.91,41.91 0 top
L3  61.47,41.91 0 top
L4  81.53,41.91 0 top
LED1  25.4,71.88 0 top
LED2  46.56,71.88 0 top
LED3  67.72,71.88 0 top
LED4  88.9,71.88 0 top
LED5  88.9,6.86 180 top
LED6  67.72,6.86 180 top
LED7  46.56,6.86 180 top
LED8  25.4,6.86 180 top
Q1  34.29,44.45 180 top
Q2  53.85,44.45 180 top
Q3  73.91,44.45 180 top
Q4  6.86,38.1 180 top
R1  2.29,35.31 90 top
R2  17.53,55.37 90 top
R3  2.29,27.94 90 top
R4  17.53,52.07 90 top
R5  4.32,41.91 180 top
R6  9.65,24.13 270 top
R7  4.32,38.86 90 top
R8  9.65,28.19 270 top
R9  12.19,28.19 270 top
R10  10.92,28.19 270 top
R11  31.75,34.8 0 top
R12  25.65,31.24 90 top
R13  28.7,34.8 0 top
R14  17.27,28.19 90 top
R15  28.19,26.67 90 top
R16  33.53,56.13 90 top
R17  40.39,49.02 180 top
R18  33.53,53.09 270 top
R19  55.63,51.05 0 top
R20  51.31,34.8 0 top
R21  18.54,25.15 90 top
R22  6.35,10.67 0 top
R23  6.35,6.86 0 top
R24  24.13,23.11 0 top
R25  34.8,56.13 90 top
R26  34.8,53.09 270 top
R27  48.26,34.8 0 top
R28  37.34,30.23 180 top
R29  42.93,25.91 0 top
R30  32.26,27.94 90 top
R31  71.12,34.8 0 top
R32  32.26,24.89 90 top
R33  6.35,3.05 0 top
R34  42.93,24.64 180 top
R35  42.93,27.18 180 top
R36  68.07,34.8 0 top
R37  57.15,54.61 90 top
R38  75.69,51.05 0 top
R39  58.42,54.61 90 top
R40  58.42,51.56 270 top
R41  66.29,50.8 180 top
R42  77.47,22.1 180 top
R43  77.47,27.18 180 top
S1  65.02,24.64 90 top
U1  6.1,30.23 0 top
U2  23.62,48.01 90 top
U3  40.39,54.61 270 top
U4  23.37,26.67 270 top
U5  37.08,26.67 270 top
U6  63.25,54.61 270 top
U7  82.55,23.88 0 top
U$1  [STI_LOGO_LOGO16_TPLACE]  90.17,31.24 90 top
U$2  [STI_LOGO_LEDBOOST]  11.68,63.5 90 top
U$3  [STI_LOGO_ROCKET]  6.1,64.52 90 top
U$4  [MSP430_LAB_TILOGO_SMALL]  7.87,76.2 270 bottom
U$6  [MSP430_LAB_TILOGO_SMALL_TSTOP]  7.87,76.2 270 bottom

### Tracks (layer width: path | path; a pad name or v marks a point on that pad's centre or on a via)
+3V3  (via drill 0.38)
  Top 0.254: U7.1 77.32,20.98 76.97,21.33 R42.2 C32.1 C34.1 R43.2 76.97,28.2 77.72,28.96 82.04,28.96 83.06,29.97 92.96,29.97 95,32 95,34.29 J5.1 | 24.38,31.75 24.53,31.89 24.68,31.74 R12.2
  Top 0.406: J6.1 71.12,17.27 74.93,21.08 74.93,23.88 75.69,24.64 C32.1 | J2.1 17.78,15.24 19.3,13.72 62.99,13.72 v65.79,16.51
  Top 0.61: v29.72,30.23 R28.2 | v10.41,16.51 10.41,21.34 14.73,25.65 14.73,28.96 16,30.23 v23.37,30.23 24.38,31.24 24.38,31.75 24.38,42.42 26.92,44.96 26.92,48.77 26.42,49.27 C33.1 25.61,49.28 U2.P$4
  Bottom 0.406: v65.79,16.51 J6.1
  Bottom 0.61: v23.37,30.23 v29.72,30.23 | v10.41,16.51 J2.1
+5V  (via drill 0.38)
  Top 0.254: R10.1 10.92,29.21 11.18,29.47 C12.2 11.18,31.5 11.94,32.26 21.08,32.26 22.35,33.53 22.35,39.88 21.6,40.63 C9.1
  Top 0.61: 20.57,44.7 21.08,44.7 21.84,45.47 U2.P$1 U2.P$2 | v8.89,19.05 8.89,21.08 13.46,25.65 13.46,29.72 14.99,31.24 22.35,31.24 23.37,32.26 23.37,40.64 21.84,42.16 19.17,42.16 C10.1
  Bottom 0.61: v8.89,19.05 J8.1
  pour Top (isolate 0.305, no thermals): 20.83,40.64 20.83,44.96 8.64,44.96 8.64,41.4 17.53,41.4 17.53,40.64
BLUE_ANODE  (via drill 0.38)
  Top 0: LED1.3 18.82,68.1 v18.54,67.82
  Top 0.254: R31.2 71.67,35.6 v72.39,36.32
  other vias: 18.54,66.8 71.37,37.34 72.39,37.34 71.37,36.32 18.54,69.85 18.54,68.83
  pour Top (isolate 0.305, no thermals): 67.31,35.81 79.25,35.81 79.25,37.85 69.85,37.85 69.85,39.62 67.31,39.62
  pour Bottom (isolate 0.305): 70.87,56.39 70.87,36.07 72.9,36.07 72.9,57.4 19.3,57.4 19.3,70.36 18.03,70.36 18.03,56.39
BLUE_CATHODE  (via drill 0.38)
  Top 0: LED8.6 22.71,10.82 v22.35,11.18
  Top 0.254: R22.2 7.77,11.58 8.64,12.45 10.67,12.45 12.7,14.48 12.7,20.83 15.24,23.37 21.59,23.37 22.61,24.38 22.61,25.65 22.23,26.04 U4.3
  other vias: 9.65,11.18 10.67,11.18 10.67,10.16 9.65,10.16 18.54,12.45 19.81,12.45 21.08,12.45 22.35,12.45 22.35,9.91
  pour Top (isolate 0.305, no thermals): 9.14,11.94 11.68,11.94 11.68,9.65 8.38,9.65 8.38,11.18
  pour Bottom (isolate 0.305): 7.11,9.14 7.11,12.95 24.89,12.95 24.89,8.38 21.34,8.38 21.34,10.92 16.51,10.92 16.51,9.14
GND  (via drill 0.38)
  Top 0.254: U5.4 33.4,24.77 33.03,24.39 R32.1 29.47,24.39 26.67,21.59 15.75,21.59 14.22,20.07 14.22,6.6 12.95,5.33 6.35,5.33 4.93,3.91 R33.1 | U6.3 58.44,53.97 R39.1 R40.1 | R25.1 R26.1 35.55,53.59 35.94,53.97 U3.3 | C25.2 v42.16,30.23 | J1.P$3 5.08,50.55 6.1,51.57 C2.2 R4.1 | C4.2 C3.2 | U1.5 20.89,32.83 21.84,33.78 21.84,38.86 21.07,39.63 C9.2 | R34.1 v44.7,24.64 | R35.1 v44.7,27.18 | v27.18,34.8 R13.1 C16.2 | R27.1 C24.2 v46.74,33.53 | R36.1 C30.2 v66.29,33.53 | R41.1 68.07,50.8 v68.33,51.05 | C5.2 2.43,30.99 | U7.20 79.62,25.27 78.99,24.64 C32.2 | v78.23,23.62 78.12,23.73 | R22.1 4.93,10.77 | 4.93,10.77 4.93,11.53 6.35,12.95 10.41,12.95 12.19,14.73 12.19,21.08 14.99,23.88 18.29,23.88 18.54,24.13 R21.1 19.31,24.65 19.43,24.77 U4.4 | 4.93,10.77 4.83,10.67 3.05,10.67 | 3.05,6.86 R23.1 4.93,7.72 6.35,9.14 12.45,9.14 13.21,9.91 13.21,20.57 15.49,22.86 21.84,22.86 22.1,23.11 R24.1 | 3.05,3.05 4.57,3.05 | C32.2 C34.2 | v78.23,23.62 78.02,23.83 | C32.2 77.97,23.88 v78.23,23.62
  Top 0.406: C5.2 1.79,31 1.02,30.23 1.02,24.64 2.02,23.63 C4.2
  Top 0.61: U6.3 62.36,53.97 62.7,53.64 C31.2 62.7,50 v62.48,49.78 62.6,49.9 | 35.05,50.8 35.31,51.05 38.1,51.05 38.61,50.55 C18.2 39.89,53.33 39.24,53.97 U3.3 | 2.43,30.99 v7.87,30.99 | R8.1 9.65,30.23 8.89,30.99 v7.87,30.99 | U1.5 8,31.11 v7.87,30.99 | v20.83,48.01 U2.P$3 25.44,48.01 C33.2
  other vias: 45.21,33.27 45.21,34.54 43.94,34.54 43.94,33.27 64.77,33.27 63.5,33.27 63.5,34.54 64.77,34.54 84.84,33.27 83.57,33.27 84.84,34.54 83.57,34.54 29.97,48.01 28.7,48.01 29.97,49.28 28.7,49.28 49.53,48.26 48.26,48.26 49.53,49.53 48.26,49.53 69.6,48.26 68.33,48.26 69.6,49.53 68.33,49.53 7.37,47.75 7.37,48.77 7.37,46.74 6.35,45.72 7.37,45.72 6.35,44.7 7.37,44.7 19.3,35.56 19.3,34.54 20.32,34.54 20.32,35.56 3.05,2.54 1.78,2.54 1.78,3.81 3.05,3.81 3.05,5.08 1.78,5.08 1.78,6.35 3.05,6.35 3.05,7.62 1.78,7.62 1.78,8.89 3.05,8.89 3.05,10.16 1.78,10.16 1.78,11.43 3.05,11.43 19.56,46.74 19.56,48.01 19.56,49.28 20.83,49.28 20.83,46.74 14.99,49.28 14.99,48.01 14.99,46.74 26.16,52.32 27.18,52.32 28.19,52.32 29.21,52.32 27.18,55.37 28.19,55.37 29.21,55.37 26.16,55.37 26.16,38.35 26.16,42.16 26.16,40.89 26.16,39.62 22.35,43.69
  pour Top (isolate 0.305, no thermals): 65.53,32.26 52.83,32.26 52.83,35.05 65.53,35.05
  pour Top (isolate 0.305, no thermals): 85.6,32.26 72.64,32.26 72.64,35.05 85.6,35.05
  pour Top (no thermals): 52.32,47.5 47.5,47.5 47.5,50.04 52.32,50.04
  pour Top (isolate 0.305, no thermals): 72.39,47.5 67.56,47.5 67.56,50.04 72.39,50.04
  pour Top (isolate 0.305, no thermals): 12.95,33.78 12.95,35.81 17.53,35.81 17.53,39.37 20.83,39.37 20.83,33.78
  pour Top (isolate 0.305, no thermals): 3.3,50.29 7.87,50.29 7.87,43.94 3.3,43.94
  pour Top (isolate 0.305, no thermals): 0.51,12.95 0.51,1.02 4.32,1.02 4.32,12.95
  pour Top (isolate 0.305, no thermals): 13.97,45.97 21.08,45.97 21.84,46.74 21.84,50.04 13.97,50.04
  pour Top (isolate 0.305, no thermals): 45.97,35.05 45.97,32.26 33.27,32.26 33.27,35.05
  pour Bottom (isolate 0.305): 0.51,0.51 5.84,0.51 5.84,13.97 95.25,13.97 95.25,64.52 25.15,64.52 25.15,77.72 17.02,77.72 17.02,54.86 53.59,54.86 53.59,36.07 57.15,36.07 57.15,38.86 70.1,38.86 70.1,55.88 17.27,55.88 17.27,71.12 20.07,71.12 20.07,58.67 73.66,58.67 73.66,36.07 77.22,36.07 77.22,39.12 86.61,39.12 86.61,35.05 83.06,35.05 83.06,31.75 66.8,31.75 66.8,35.05 63.25,35.05 63.25,31.75 47.24,31.75 47.24,35.05 43.43,35.05 43.43,31.24 0.51,31.24
  pour Top (isolate 0.305, no thermals): 21.59,44.2 21.59,42.93 22.35,42.93 23.37,41.91 23.37,32.77 22.1,31.5 29.46,31.5 28.19,32.77 28.19,35.05 27.18,35.05 27.18,45.97 27.69,46.48 35.05,46.48 35.56,46.99 35.56,51.05 35.31,51.31 32.77,51.31 32.51,51.56 32.51,53.85 31.75,54.61 31.75,64.77 19.3,64.77 18.8,64.26 18.8,51.05 24.89,51.05 25.4,50.55 25.4,44.96 24.89,44.45 21.84,44.45
  pour Bottom (isolate 0.305): 4.57,34.29 37.85,34.29 37.85,39.12 50.04,39.12 50.04,52.83 14.48,52.83 14.48,77.98 13.97,77.98 13.97,51.82 34.29,51.82 34.29,35.31 30.48,35.31 30.48,49.78 11.43,49.78 11.43,77.98 0.51,77.98 0.51,62.48 7.62,62.48 7.62,55.88 4.57,55.88
GPIO28
  Top 0.254: S1.P$2 60.72,16.52 58.67,14.48 36.58,14.48 35.56,15.49 J3.3
GPIO29
  Top 0.254: S1.P$4 59.18,25.91 58.42,25.15 58.42,16.26 57.15,14.99 38.35,14.99 38.1,15.24 J3.4
GREEN_ANODE  (via drill 0.38)
  Top 0.254: R11.2 32.25,35.81 v32.77,36.32
  other vias: 31.75,37.34 32.77,37.34 31.75,36.32 12.7,76.96 12.7,75.95 12.7,74.93 12.7,73.91
  pour Top (isolate 0.305, no thermals): 27.94,35.81 39.62,35.81 39.62,37.85 30.23,37.85 30.23,39.88 27.94,39.88
  pour Bottom (isolate 0.305): 31.24,50.29 31.24,35.81 33.53,35.81 33.53,51.31 13.21,51.31 13.21,77.72 12.19,77.72 12.19,50.29
  pour Top (isolate 0.305, no thermals): 23.37,77.98 12.19,77.98 12.19,73.41 23.37,73.41
GREEN_CATHODE  (via drill 0.38)
  Top 0: LED8.4 22.71,2.9 v22.35,2.54
  Top 0.254: R33.2 7.77,3.96 8.64,4.83 13.21,4.83 14.73,6.35 14.73,19.81 16,21.08 26.92,21.08 29.21,23.37 35.56,23.37 36.32,24.13 36.32,25.65 35.94,26.04 U5.3
  other vias: 9.65,3.56 10.67,3.56 10.67,2.54 9.65,2.54 18.54,1.27 19.81,1.27 21.08,1.27 22.35,1.27 22.35,3.81
  pour Top (isolate 0.305, no thermals): 9.14,4.32 11.68,4.32 11.68,2.03 8.38,2.03 8.38,3.56
  pour Bottom (isolate 0.305): 7.11,4.83 7.11,0.76 24.89,0.76 24.89,5.33 21.34,5.33 21.34,2.79 16.51,2.79 16.51,4.83
IBLUE  (via drill 0.38)
  Top 0.254: v16,20.07 16.26,20.07 16.76,20.57 27.18,20.57 29.21,22.61 v37.85,22.61 | v11.43,20.57 11.43,21.08 16.26,25.91 16.26,28.19 16.81,28.74 R14.2 C19.1 19.3,28.69 19.3,28.7 19.43,28.57 U4.1 | v40.39,22.61 45.47,22.61 46.99,21.08 46.99,17.78 J3.8
  Bottom 0.254: v16,20.07 11.94,20.07 v11.43,20.57 | v37.85,22.61 v40.39,22.61
IGREEN
  Top 0.254: C26.1 R30.2 32.27,28.57 U5.1 36.2,28.57 37.85,26.92 37.85,23.88 40.64,21.08 J9.5
IRED  (via drill 0.38)
  Top 0.254: U4.7 28.18,27.3 R15.2 C20.1 29.98,27.17 30.23,26.92 30.23,25.15 29.97,24.89 28.7,24.89 v26.92,23.11 | v29.72,21.84 30.73,21.84 31.75,20.83 31.75,17.78 J3.2
  Bottom 0.254: v26.92,23.11 28.45,23.11 v29.72,21.84
ISO_3V3  (via drill 0.38)
  Top 0.61: J11.1 65.53,62.23 73.91,53.85 78.49,53.85 86.87,45.47 86.87,31.75 86.36,31.24 82.55,31.24 81.53,30.23 59.69,30.23 56.13,26.67 v56.13,16.26
  Top 0.813: J2.2 J3.1
  Bottom 0.61: v56.13,16.26 54.36,14.48 31.24,14.48 30.48,15.24 J3.1
N$1
  Top 0.254: U1.1 4.19,24.91 C3.1 3.31,24.63 2.29,25.65 R3.1
N$2
  Top 0.254: U1.2 5.46,24.91 C4.1
N$3
  Top 0.254: U1.3 6.73,24.91 C8.1 C7.1
N$4
  Top 0.254: U7.10 90.78,20.98 93.98,17.78 J6.10
N$5
  Top 0.254: C7.2 8.64,23.37 8.9,23.63 R6.2
N$6
  pour Top (isolate 0.305, no thermals): 16.51,39.88 16.51,36.58 11.18,36.58 11.18,33.78 9.14,33.78 9.14,36.07 6.1,36.07 6.1,37.85 8.64,37.85 8.64,39.88
N$7
  Top 0.254: R9.1 12.23,28.79 12.23,30.18 C12.1
N$8
  Top 0.254: U7.9 84.83,20.08 85.09,19.81 89.41,19.81 91.44,17.78 J6.9
N$9  (via drill 0.38)
  Top 0.254: 4.19,34.78 U1.8 | R3.2 v2.29,29.72 | v1.27,32.26 1.38,32.15 | C6.1 4.32,34.91 4.19,34.78 | 4.19,34.78 4.16,34.76 | v1.27,32.26 1.48,32.05 | v1.27,32.26 1.53,32 C5.1 R1.1 4.17,34.81 4.19,34.78
  Bottom 0.254: v2.29,29.72 2.03,29.72 1.27,30.48 v1.27,32.26
N$10
  Top 0.254: R7.1 C6.2 5.04,36.36 5.46,35.94 U1.7
N$11
  Top 0.254: Q4.2 5.85,39.26 | Q4.2 5.7,39.41 | R7.2 5.75,39.36 Q4.2
  pour Top (isolate 0.305, no thermals): 5.08,43.18 7.62,43.18 7.62,40.39 6.6,40.39 6.6,38.61 5.08,38.61
N$12
  Top 0.254: U7.8 84.17,19.46 84.58,19.05 87.63,19.05 88.9,17.78 J6.8
N$14  (via drill 0.38)
  Top 0: LED2.2 v41.66,71.88 | LED1.5 30.23,71.88 v31.5,72.39
  other vias: 39.62,71.88 40.64,71.88 31.5,71.12 32.77,71.12 32.77,72.39 31.5,73.66 32.77,73.66 32.77,69.85 31.5,69.85
  pour Bottom (isolate 0.305): 45.72,71.12 45.72,72.64 33.53,72.64 33.53,75.18 30.48,75.18 30.48,72.64 25.91,72.64 25.91,71.12 30.48,71.12 30.48,68.58 33.53,68.58 33.53,71.12
N$15
  Top 0.254: R16.2 R25.2 35.31,56.63 36.07,55.88 36.07,55.63 36.45,55.25 U3.2
N$16
  Top 0.61: U6.7 68.96,55.25 73.15,51.05 R38.1
N$17  (via drill 0.38)
  Top 0: LED2.1 42.12,76.15 v42.16,76.2 | LED1.4 28.09,75.84 v28.45,76.2
  other vias: 39.62,77.47 40.89,77.47 42.16,77.47 43.43,77.47 40.89,76.2 32.26,77.47 30.99,77.47 29.72,77.47 28.45,77.47 28.45,74.93
  pour Bottom (isolate 0.305): 45.72,73.41 45.72,77.72 25.91,77.72 25.91,73.41 29.72,73.41 29.72,75.95 34.29,75.95 34.29,73.41
N$18  (via drill 0.38)
  Top 0: LED2.3 42.12,67.61 v42.16,67.56 | LED1.6 28.09,67.92 v28.45,67.56
  other vias: 39.62,66.29 40.89,66.29 42.16,66.29 43.43,66.29 40.89,67.56 32.26,66.29 30.99,66.29 29.72,66.29 28.45,66.29 28.45,68.83
  pour Bottom (isolate 0.305): 45.72,65.53 45.72,70.36 34.29,70.36 34.29,67.82 29.72,67.82 29.72,70.36 25.91,70.36 25.91,65.53
N$19  (via drill 0.38)
  Top 0.254: U1.6 6.73,34.92 v6.86,35.05 | Q4.1 7.81,40.07 v8.38,40.64
  Bottom 0.254: v6.86,35.05 7.62,35.05 7.87,35.31 7.87,40.13 v8.38,40.64
N$20
  Top 0.254: U7.7 83.53,19.09 84.33,18.29 85.85,18.29 86.36,17.78 J6.7
N$21  (via drill 0.38)
  Top 0: LED3.2 v62.74,71.88 | LED2.5 51.31,71.88 v52.58,72.39
  other vias: 60.71,71.88 61.72,71.88 52.58,71.12 53.85,71.12 53.85,72.39 52.58,73.66 53.85,73.66 53.85,69.85 52.58,69.85
  pour Bottom (isolate 0.305): 66.8,71.12 66.8,72.64 54.61,72.64 54.61,75.18 51.56,75.18 51.56,72.64 46.99,72.64 46.99,71.12 51.56,71.12 51.56,68.58 54.61,68.58 54.61,71.12
N$22  (via drill 0.38)
  Top 0: LED3.1 63.27,76.17 v63.25,76.2 | LED2.4 49.25,75.92 v49.53,76.2
  other vias: 60.71,77.47 61.98,77.47 63.25,77.47 64.52,77.47 61.98,76.2 53.34,77.47 52.07,77.47 50.8,77.47 49.53,77.47 49.53,74.93
  pour Bottom (isolate 0.305): 66.8,73.41 66.8,77.72 46.99,77.72 46.99,73.41 50.8,73.41 50.8,75.95 55.37,75.95 55.37,73.41
N$23  (via drill 0.38)
  Top 0: LED3.3 63.27,67.59 v63.25,67.56 | LED2.6 49.25,67.84 v49.53,67.56
  other vias: 60.71,66.29 61.98,66.29 63.25,66.29 64.52,66.29 61.98,67.56 53.34,66.29 52.07,66.29 50.8,66.29 49.53,66.29 49.53,68.83
  pour Bottom (isolate 0.305): 66.8,65.53 66.8,70.36 55.37,70.36 55.37,67.82 50.8,67.82 50.8,70.36 46.99,70.36 46.99,65.53
N$24
  Top 0.61: U3.5 42.99,49.84 42.16,49.02 R17.1
N$25  (via drill 0.38)
  Top 0: LED3.5 72.64,71.88 v73.66,72.39 | LED4.2 v84.07,71.88
  other vias: 82.04,71.88 83.06,71.88 73.66,71.12 74.93,71.12 74.93,72.39 73.66,73.66 74.93,73.66 74.93,69.85 73.66,69.85
  pour Bottom (isolate 0.305): 88.14,71.12 88.14,72.64 75.69,72.64 75.69,75.18 72.9,75.18 72.9,72.64 68.33,72.64 68.33,71.12 72.9,71.12 72.9,68.58 75.69,68.58 75.69,71.12
N$26  (via drill 0.38)
  Top 0: v70.87,76.2 70.87,76.12 LED3.4 | LED4.1 84.46,76.08 v84.58,76.2
  other vias: 82.04,77.47 83.31,77.47 84.58,77.47 85.85,77.47 83.31,76.2 74.68,77.47 73.41,77.47 72.14,77.47 70.87,77.47 70.87,74.93
  pour Bottom (isolate 0.305): 88.14,73.41 88.14,77.72 68.33,77.72 68.33,73.41 72.14,73.41 72.14,75.95 76.45,75.95 76.45,73.41
N$27  (via drill 0.38)
  Top 0: LED3.6 70.41,68.02 v70.87,67.56 | LED4.3 84.46,67.69 v84.58,67.56
  other vias: 82.04,66.29 83.31,66.29 84.58,66.29 85.85,66.29 83.31,67.56 74.68,66.29 73.41,66.29 72.14,66.29 70.87,66.29 70.87,68.83
  pour Bottom (isolate 0.305): 88.14,65.53 88.14,70.36 76.45,70.36 76.45,67.82 72.14,67.82 72.14,70.36 68.33,70.36 68.33,65.53
N$28  (via drill 0.38)
  Top 0: LED4.5 93.73,71.88 v94.74,72.39 | LED5.2 v93.73,6.86
  other vias: 95.76,6.86 94.74,6.86 96.01,72.39 94.74,71.12 96.01,71.12 96.01,69.85 94.74,69.85 94.74,73.66 96.01,73.66
  pour Bottom (isolate 0.305): 89.66,7.62 89.66,6.1 98.81,6.1 98.81,75.18 93.98,75.18 93.98,72.64 89.41,72.64 89.41,71.12 93.98,71.12 93.98,68.58 97.79,68.58 97.79,7.62
N$29
  Top 0.254: U7.6 82.88,18.73 83.82,17.78 J6.6
N$30  (1 unrouted)
  Top 0.61: 23.51,50.66 23.51,52.22 C11.1
N$31
  Top 0.254: U3.4 35.94,52.7 35.82,52.59 R26.2 R18.2
N$32
  Top 0.61: Q3.1 76.22,49.28 | Q3.1 76.34,49.4 | Q3.1 76.24,49.3 | R38.2 Q3.1
N$33
  pour Top (isolate 0.305, no thermals): 78.99,38.61 78.99,42.67 84.84,42.67 84.84,45.47 67.56,45.47 67.56,42.16 70.87,42.16 70.87,38.61
N$34
  Top 0.254: U6.2 58.44,55.25 R39.2 R37.2
N$35
  Top 0.254: U5.7 41.27,27.3 41.4,27.18 R35.2
N$36
  Top 0.254: U5.2 32.27,27.3 R30.1 | R32.2 R30.1 | R30.1 C26.2
N$37
  Top 0.254: C19.2 R21.2 | R14.1 C19.2 | U4.2 19.43,27.3 19.04,27.69 C19.2
N$38
  Top 0.254: J6.5 81.28,17.78 82.22,18.73 U7.5 82.22,21.91 82.04,22.1 R42.1
N$39
  Top 0.254: R28.1 C25.1 39.68,30.17 U5.8 45.59,28.57 45.97,28.19 45.97,26.42 45.47,25.91 R29.2
N$40
  Top 0.254: C20.2 R15.1 28.18,26.04 U4.6 24.77,26.04 24.27,25.54 24.27,23.99 24.63,23.63 R24.2
N$41
  pour Top: 34.29,12.95 37.59,12.95 37.59,0.76 34.29,0.76
  pour Top: 55.37,12.95 58.93,12.95 58.93,0.76 55.37,0.76
  pour Top: 76.71,12.95 80.01,12.95 80.01,0.76 76.71,0.76
  pour Top: 34.29,77.98 37.59,77.98 37.59,65.79 34.29,65.79
  pour Top: 55.37,77.98 58.93,77.98 58.93,65.79 55.37,65.79
  pour Top: 76.71,77.98 80.01,77.98 80.01,65.79 76.71,65.79
N$42
  Top 0.254: C17.1 R12.1 25.97,30.43 U4.8
N$43
  Top 0.61: U3.7 45.59,55.25 49.78,51.05 R19.1
N$44
  Top 0.61: Q2.1 56.28,49.4 | Q2.1 56.18,49.3 | R19.2 Q2.1
N$45
  Top 0.61: 36.72,49.4 Q1.1 36.8,49.02 R17.2
N$46
  pour Top (isolate 0.305, no thermals): 39.37,38.61 39.37,42.67 45.97,42.67 45.97,45.47 27.94,45.47 27.94,42.42 31.24,42.42 31.24,38.61
N$47
  pour Top (isolate 0.305, no thermals): 58.93,38.61 58.93,42.67 65.53,42.67 65.53,45.47 47.5,45.47 47.5,42.42 50.8,42.42 50.8,38.61
N$49
  Top 0.254: U7.2 80.28,20.08 80.01,19.81 75.69,19.81 73.66,17.78 J6.2
N$50  (via drill 0.38)
  Top 0: LED4.4 91.59,75.84 v91.95,76.2 | LED5.1 93.34,2.92 v92.96,2.54
  other vias: 95.5,1.27 94.23,1.27 92.96,1.27 91.69,1.27 94.23,2.54 95.76,77.47 94.49,77.47 93.22,77.47 91.95,77.47 91.95,74.93
  pour Bottom (isolate 0.305): 89.41,73.41 89.41,77.98 101.09,77.98 101.09,0.76 89.66,0.76 89.66,5.33 99.57,5.33 99.57,75.95 93.22,75.95 93.22,73.41
N$51  (via drill 0.38)
  Top 0: LED4.6 91.59,67.92 v91.95,67.56 | LED5.3 93.34,10.8 v92.96,11.18
  other vias: 95.5,12.45 94.23,12.45 92.96,12.45 91.69,12.45 94.23,11.18 95.76,66.29 94.49,66.29 93.22,66.29 91.95,66.29 91.95,68.83
  pour Bottom (isolate 0.305): 89.66,8.38 97.03,8.38 97.03,67.82 93.22,67.82 93.22,70.36 89.41,70.36 89.41,65.53 96.01,65.53 96.01,13.21 89.66,13.21
N$52
  Top 0.254: R9.2 R10.2 R8.2 9.57,27.63 U1.4 8,24.91 C8.2 8.64,24.89 8.9,24.63 R6.1
N$53  (via drill 0.38)
  Top 0.254: U7.19 80.28,24.88 81.79,23.37 92.46,23.37 v92.71,23.11 | J7.2 73.66,60.2 88.14,45.72 88.14,32.77 89.66,31.24 v92.71,31.24
  Bottom 0.254: v92.71,23.11 v92.71,31.24
N$54  (via drill 0.38)
  Top 0.254: U7.18 80.92,25.25 82.04,24.13 93.22,24.13 v93.47,23.88 | J7.3 76.2,60.2 88.9,47.5 88.9,33.53 90.17,32.26 93.22,32.26 v93.47,32
  Bottom 0.254: v93.47,23.88 v93.47,32
N$57
  Top 0.254: U7.15 82.88,28.77 83.57,29.46 95.25,29.46 96.52,30.73 96.52,50.29 94.74,52.07 92.71,52.07 83.82,60.96 J7.6
N$58
  Top 0.254: U7.14 83.53,28.41 84.07,28.96 86.87,28.96 87.12,28.7 95.5,28.7 97.28,30.48 97.28,50.8 95.25,52.83 94.49,52.83 86.36,60.96 J7.7
N$59  (via drill 0.38)
  Top 0: LED6.2 v72.39,6.86 | LED5.5 83.82,6.86 v83.06,6.35
  other vias: 74.42,6.86 73.41,6.86 83.06,7.62 81.79,7.62 81.79,6.35 83.06,5.08 81.79,5.08 81.79,8.89 83.06,8.89
  pour Bottom (isolate 0.305): 68.33,7.62 68.33,6.1 80.77,6.1 80.77,3.56 83.82,3.56 83.82,6.1 88.14,6.1 88.14,7.62 83.82,7.62 83.82,10.16 80.77,10.16 80.77,7.62
N$60  (via drill 0.38)
  Top 0: LED6.1 72.16,2.82 v71.88,2.54 | LED5.4 86.13,3.07 v85.6,2.54
  other vias: 74.42,1.27 73.15,1.27 71.88,1.27 70.61,1.27 73.15,2.54 81.79,1.27 83.06,1.27 84.33,1.27 85.6,1.27 85.6,3.81
  pour Bottom (isolate 0.305): 68.33,5.33 68.33,1.02 88.14,1.02 88.14,5.33 84.58,5.33 84.58,2.79 80.01,2.79 80.01,5.33
N$61  (via drill 0.38)
  Top 0: LED6.3 72.16,10.9 v71.88,11.18 | LED5.6 86.13,10.64 v85.6,11.18
  other vias: 74.42,12.45 73.15,12.45 71.88,12.45 70.61,12.45 73.15,11.18 81.79,12.45 83.06,12.45 84.33,12.45 85.6,12.45 85.6,9.91
  pour Bottom (isolate 0.305): 68.33,13.21 68.33,8.38 80.01,8.38 80.01,10.92 84.58,10.92 84.58,8.38 88.14,8.38 88.14,13.21
N$62  (via drill 0.38)
  Top 0: LED7.2 v51.31,6.86 | LED6.5 62.48,6.86 v61.72,6.35
  other vias: 53.34,6.86 52.32,6.86 61.72,7.62 60.45,7.62 60.45,6.35 61.72,5.08 60.45,5.08 60.45,8.89 61.72,8.89
  pour Bottom (isolate 0.305): 47.24,7.62 47.24,6.1 59.69,6.1 59.69,3.56 62.74,3.56 62.74,6.1 67.06,6.1 67.06,7.62 62.74,7.62 62.74,10.16 59.69,10.16 59.69,7.62
N$63  (via drill 0.38)
  Top 0: LED7.1 51,2.74 v50.8,2.54 | LED6.4 65.02,3.05 v64.52,2.54
  other vias: 53.34,1.27 52.07,1.27 50.8,1.27 49.53,1.27 52.07,2.54 60.71,1.27 61.98,1.27 63.25,1.27 64.52,1.27 64.52,3.81
  pour Bottom (isolate 0.305): 47.24,5.33 47.24,1.02 67.06,1.02 67.06,5.33 63.5,5.33 63.5,2.79 58.93,2.79 58.93,5.33
N$64  (via drill 0.38)
  Top 0: LED7.3 51,10.97 v50.8,11.18 | LED6.6 65.02,10.67 v64.52,11.18
  other vias: 53.34,12.45 52.07,12.45 50.8,12.45 49.53,12.45 52.07,11.18 60.71,12.45 61.98,12.45 63.25,12.45 64.52,12.45 64.52,9.91
  pour Bottom (isolate 0.305): 47.24,13.21 47.24,8.38 58.93,8.38 58.93,10.92 63.5,10.92 63.5,8.38 67.06,8.38 67.06,13.21
N$65  (via drill 0.38)
  Top 0: LED8.2 v30.23,6.86 | LED7.5 41.4,6.86 v40.64,6.35
  other vias: 32.26,6.86 31.24,6.86 40.64,7.62 39.37,7.62 39.37,6.35 39.37,5.08 40.64,5.08 39.37,8.89 40.64,8.89
  pour Bottom (isolate 0.305): 25.91,7.62 25.91,6.1 38.35,6.1 38.35,3.56 41.66,3.56 41.66,6.1 45.97,6.1 45.97,7.62 41.66,7.62 41.66,10.16 38.35,10.16 38.35,7.62
N$66  (via drill 0.38)
  Top 0: LED8.1 29.84,2.66 v29.72,2.54 | LED7.4 43.87,2.97 v43.43,2.54
  other vias: 32.26,1.27 30.99,1.27 29.72,1.27 28.45,1.27 30.99,2.54 39.62,1.27 40.89,1.27 42.16,1.27 43.43,1.27 43.43,3.81
  pour Bottom (isolate 0.305): 25.91,5.33 25.91,1.02 45.97,1.02 45.97,5.33 42.42,5.33 42.42,2.79 37.59,2.79 37.59,5.33
N$67  (via drill 0.38)
  Top 0: LED8.3 29.84,11.05 v29.72,11.18 | LED7.6 43.87,10.74 v43.43,11.18
  other vias: 32.26,12.45 30.99,12.45 29.72,12.45 28.45,12.45 30.99,11.18 39.62,12.45 40.89,12.45 42.16,12.45 43.43,12.45 43.43,9.91
  pour Bottom (isolate 0.305): 25.91,13.21 25.91,8.38 37.59,8.38 37.59,10.92 42.42,10.92 42.42,8.38 45.97,8.38 45.97,13.21
N$68
  Top 0.254: U7.13 84.17,28.04 84.58,28.45 86.36,28.45 86.87,27.94 95.76,27.94 98.04,30.23 98.04,51.82 88.9,60.96 J7.8
N$69
  Top 0.254: U7.12 84.83,27.67 85.09,27.94 85.85,27.94 86.61,27.18 96.01,27.18 98.81,29.97 98.81,53.59 91.44,60.96 J7.9
N$70
  Top 0.254: J7.10 93.98,60.96 99.57,55.37 99.57,29.72 96.27,26.42 86.11,26.42 85.75,26.78 U7.11
N$71
  Top 0.254: U5.6 41.27,26.04 41.4,25.91 R29.1
N$72
  Top 0.254: U5.5 41.27,24.77 41.4,24.64 R34.2
N$73
  Bottom 0.254: 6.6,77.72 9.65,77.72 9.65,74.68 6.6,74.68 6.6,77.72
N$75
  Top 0.813: J8.2 J9.1
N$85
  Top 0.254: U6.4 60.71,52.64 60.71,51.82 59.95,51.06 R40.2
N$86
  Top 0.254: 65.85,52.52 U6.5 65.74,52.6 65.74,50.85 R41.2
PWM-1A  (via drill 0.38)
  Top 0.254: v39.37,58.17 39.62,57.91 45.47,57.91 49.27,54.11 R37.1
  Bottom 0.254: v39.37,58.17 39.12,57.91 31.24,57.91 30.48,58.67 J10.1
PWM-1B
  Top 0.254: J10.2 32.26,58.93 32.26,54.36 33.03,53.59 R18.1
PWM-2A
  Top 0.254: J10.3 35.56,58.17 35.05,57.66 33.02,57.66 32.77,57.4 32.77,55.88 33.01,55.63 R16.1
RED_ANODE  (via drill 0.38)
  Top 0.254: R20.2 51.81,35.81 v52.32,36.32
  other vias: 15.75,71.88 51.31,37.34 52.32,37.34 51.31,36.32 15.75,70.87 15.75,69.85 15.75,68.83
  pour Top (isolate 0.305, no thermals): 59.18,35.81 59.18,37.85 49.53,37.85 49.53,39.88 47.24,39.88 47.24,35.81
  pour Bottom (isolate 0.305): 50.8,36.07 52.83,36.07 52.83,54.36 16.26,54.36 16.26,77.72 15.24,77.72 15.24,53.34 50.8,53.34
  pour Top (isolate 0.305, no thermals): 23.37,72.39 23.37,71.37 16.26,71.37 16.26,68.33 15.24,68.33 15.24,72.39
RED_CATHODE  (via drill 0.38)
  Top 0: LED8.5 20.32,6.86 v19.56,6.35
  Top 0.254: R23.2 7.77,7.77 8.64,8.64 12.7,8.64 13.72,9.65 13.72,20.32 15.49,22.1 25.15,22.1 25.97,22.92 U4.5
  other vias: 9.65,7.37 10.67,7.37 10.67,6.35 9.65,6.35 18.29,7.62 18.29,6.35 19.56,7.62 18.29,8.89 19.56,8.89 18.29,5.08 19.56,5.08
  pour Top (isolate 0.305, no thermals): 9.14,8.13 11.68,8.13 11.68,5.84 8.38,5.84 8.38,7.37
  pour Bottom (isolate 0.305): 7.11,8.38 7.11,5.59 17.27,5.59 17.27,3.56 20.57,3.56 20.57,6.1 24.89,6.1 24.89,7.62 20.57,7.62 20.57,10.16 17.27,10.16 17.27,8.38
RST  (via drill 0.38)
  Top 0.254: 95.76,42.93 95.76,31.5 v95,30.73 | 95.76,42.93 95.76,49.78 94.49,51.05 91.19,51.05 81.28,60.96 J7.5 | v95,25.4 94.74,25.65 82.55,25.65 82.22,25.98 U7.16 82.22,27.76 81.79,28.19 78.49,28.19 77.97,27.68 R43.1 | 95.76,42.93 J5.4
  Bottom 0.254: v95,25.4 v95,30.73
RXD
  Top 0.254: U7.4 81.58,19.09 80.77,18.29 79.25,18.29 78.74,17.78 J6.4 78.74,14.99 77.98,14.22 68.83,14.22 67.31,15.75 67.31,19.81 66.29,20.83 66.29,24.38 67.82,25.91 S1.P$3
  Bottom 0.254: J5.3 92.71,40.39 92.2,39.88 92.2,34.29 91.69,33.78 91.69,19.81 90.17,18.29 79.25,18.29 78.74,17.78 J6.4
TEST  (via drill 0.38)
  Top 0.254: J7.4 78.74,60.2 89.66,49.28 89.66,45.47 | U7.17 81.58,25.61 82.3,24.89 93.98,24.89 v94.23,24.64 | v93.47,33.27 90.68,33.27 89.66,34.29 89.66,45.47 | 89.66,45.47 J5.5
  Bottom 0.254: v94.23,24.64 94.23,31.24 94.49,31.5 94.49,32.77 93.98,33.27 v93.47,33.27
TXD  (via drill 0.38)
  Top 0.254: U7.3 80.92,19.46 80.52,19.05 77.47,19.05 76.2,17.78 J6.3 | J5.2 91.44,37.85 v90.93,37.34 | v69.34,19.05 69.34,22.85 S1.P$1
  Bottom 0.254: v90.93,37.34 90.93,20.57 89.41,19.05 77.47,19.05 76.2,17.78 | 76.2,17.78 J6.3 | 76.2,17.78 74.93,19.05 v69.34,19.05
V+  (via drill 0.38)
  Top 0.254: J1.P$1 5.08,56.9 6.1,55.87 R2.2 | R1.2 2.29,41.74 R5.2
  Top 0.61: U6.6 64.14,53.97 63.8,53.64 C31.1 63.8,50.25 66.55,47.5 66.55,38.1 66.04,37.59 v64.77,37.59 | v45.21,37.59 46.48,37.59 46.74,37.85 46.74,52.32 45.09,53.97 U3.6 41.53,53.97 40.89,53.33 C18.1
  Top 1.27: J1.P$1 4.74,59.1 2.03,56.39 2.03,44.83 C1.1 2.12,44.49 R5.2
  other vias: 45.21,36.32 43.94,36.32 43.94,37.59 64.77,36.32 63.5,37.59 63.5,36.32 84.84,36.32 83.57,36.32 84.84,37.59 83.57,37.59 4.06,60.96 5.33,60.96 2.79,60.96 2.79,59.69 1.52,59.69 1.52,60.96 1.52,58.42 2.79,58.42 4.06,57.15 2.79,57.15 1.52,57.15 5.33,57.15
  pour Top (isolate 0.305, no thermals): 40.39,35.81 40.39,41.15 45.97,41.15 45.97,35.81
  pour Top (isolate 0.305, no thermals): 0.76,61.72 6.86,61.72 6.86,56.64 0.76,56.64
  pour Top (isolate 0.305, no thermals): 59.94,35.81 59.94,41.15 65.53,41.15 65.53,35.81
  pour Top (isolate 0.305, no thermals): 80.01,35.81 80.01,41.15 85.6,41.15 85.6,35.81
  pour Bottom (isolate 0.305): 1.02,61.72 6.86,61.72 6.86,56.64 3.81,56.64 3.81,33.53 38.61,33.53 38.61,38.35 50.04,38.35 50.04,35.31 57.91,35.31 57.91,38.1 70.1,38.1 70.1,35.31 77.98,35.31 77.98,38.35 85.85,38.35 85.85,35.81 82.3,35.81 82.3,32.51 67.56,32.51 67.56,35.81 62.48,35.81 62.48,32.51 48.01,32.51 48.01,35.81 42.67,35.81 42.67,32 1.02,32
VBLUE  (via drill 0.38)
  Top 0.254: R31.1 R36.2 C30.1 68.72,32.15 67.56,30.99 57.66,30.99 50.55,23.88 v50.55,23.11 | v45.21,21.59 45.72,21.08 J9.7
  Bottom 0.254: v50.55,23.11 46.74,23.11 v45.21,21.59
VDCIN
  Top 0.254: C2.1 R4.2 | R4.2 R2.1 | J4.10 50.8,64.77 19.56,64.77 18.8,64.01 18.8,53.34 18.08,52.62 R4.2
VGREEN
  Top 0.254: R11.1 R13.2 C16.1 29.25,32.98 30.99,31.24 45.97,31.24 47.75,29.46 47.75,22.86 49.53,21.08 49.53,17.78 J3.9
VRED
  Top 0.254: R20.1 R27.2 C24.1 48.91,23.23 52.07,20.07 52.07,17.78 J3.10

### Text on the board
Bottom: BOOSTXL-C2KLED
tPlace: v1.0 | Serial | 5V | 5V | 3V3
bStop: BOOSTXL-C2KLED
214bmp: D:/SmartProjects/Snc/a4_bn_logo2.bmp